# Altium project MainBoard.PrjPCB (part 1 of 2)
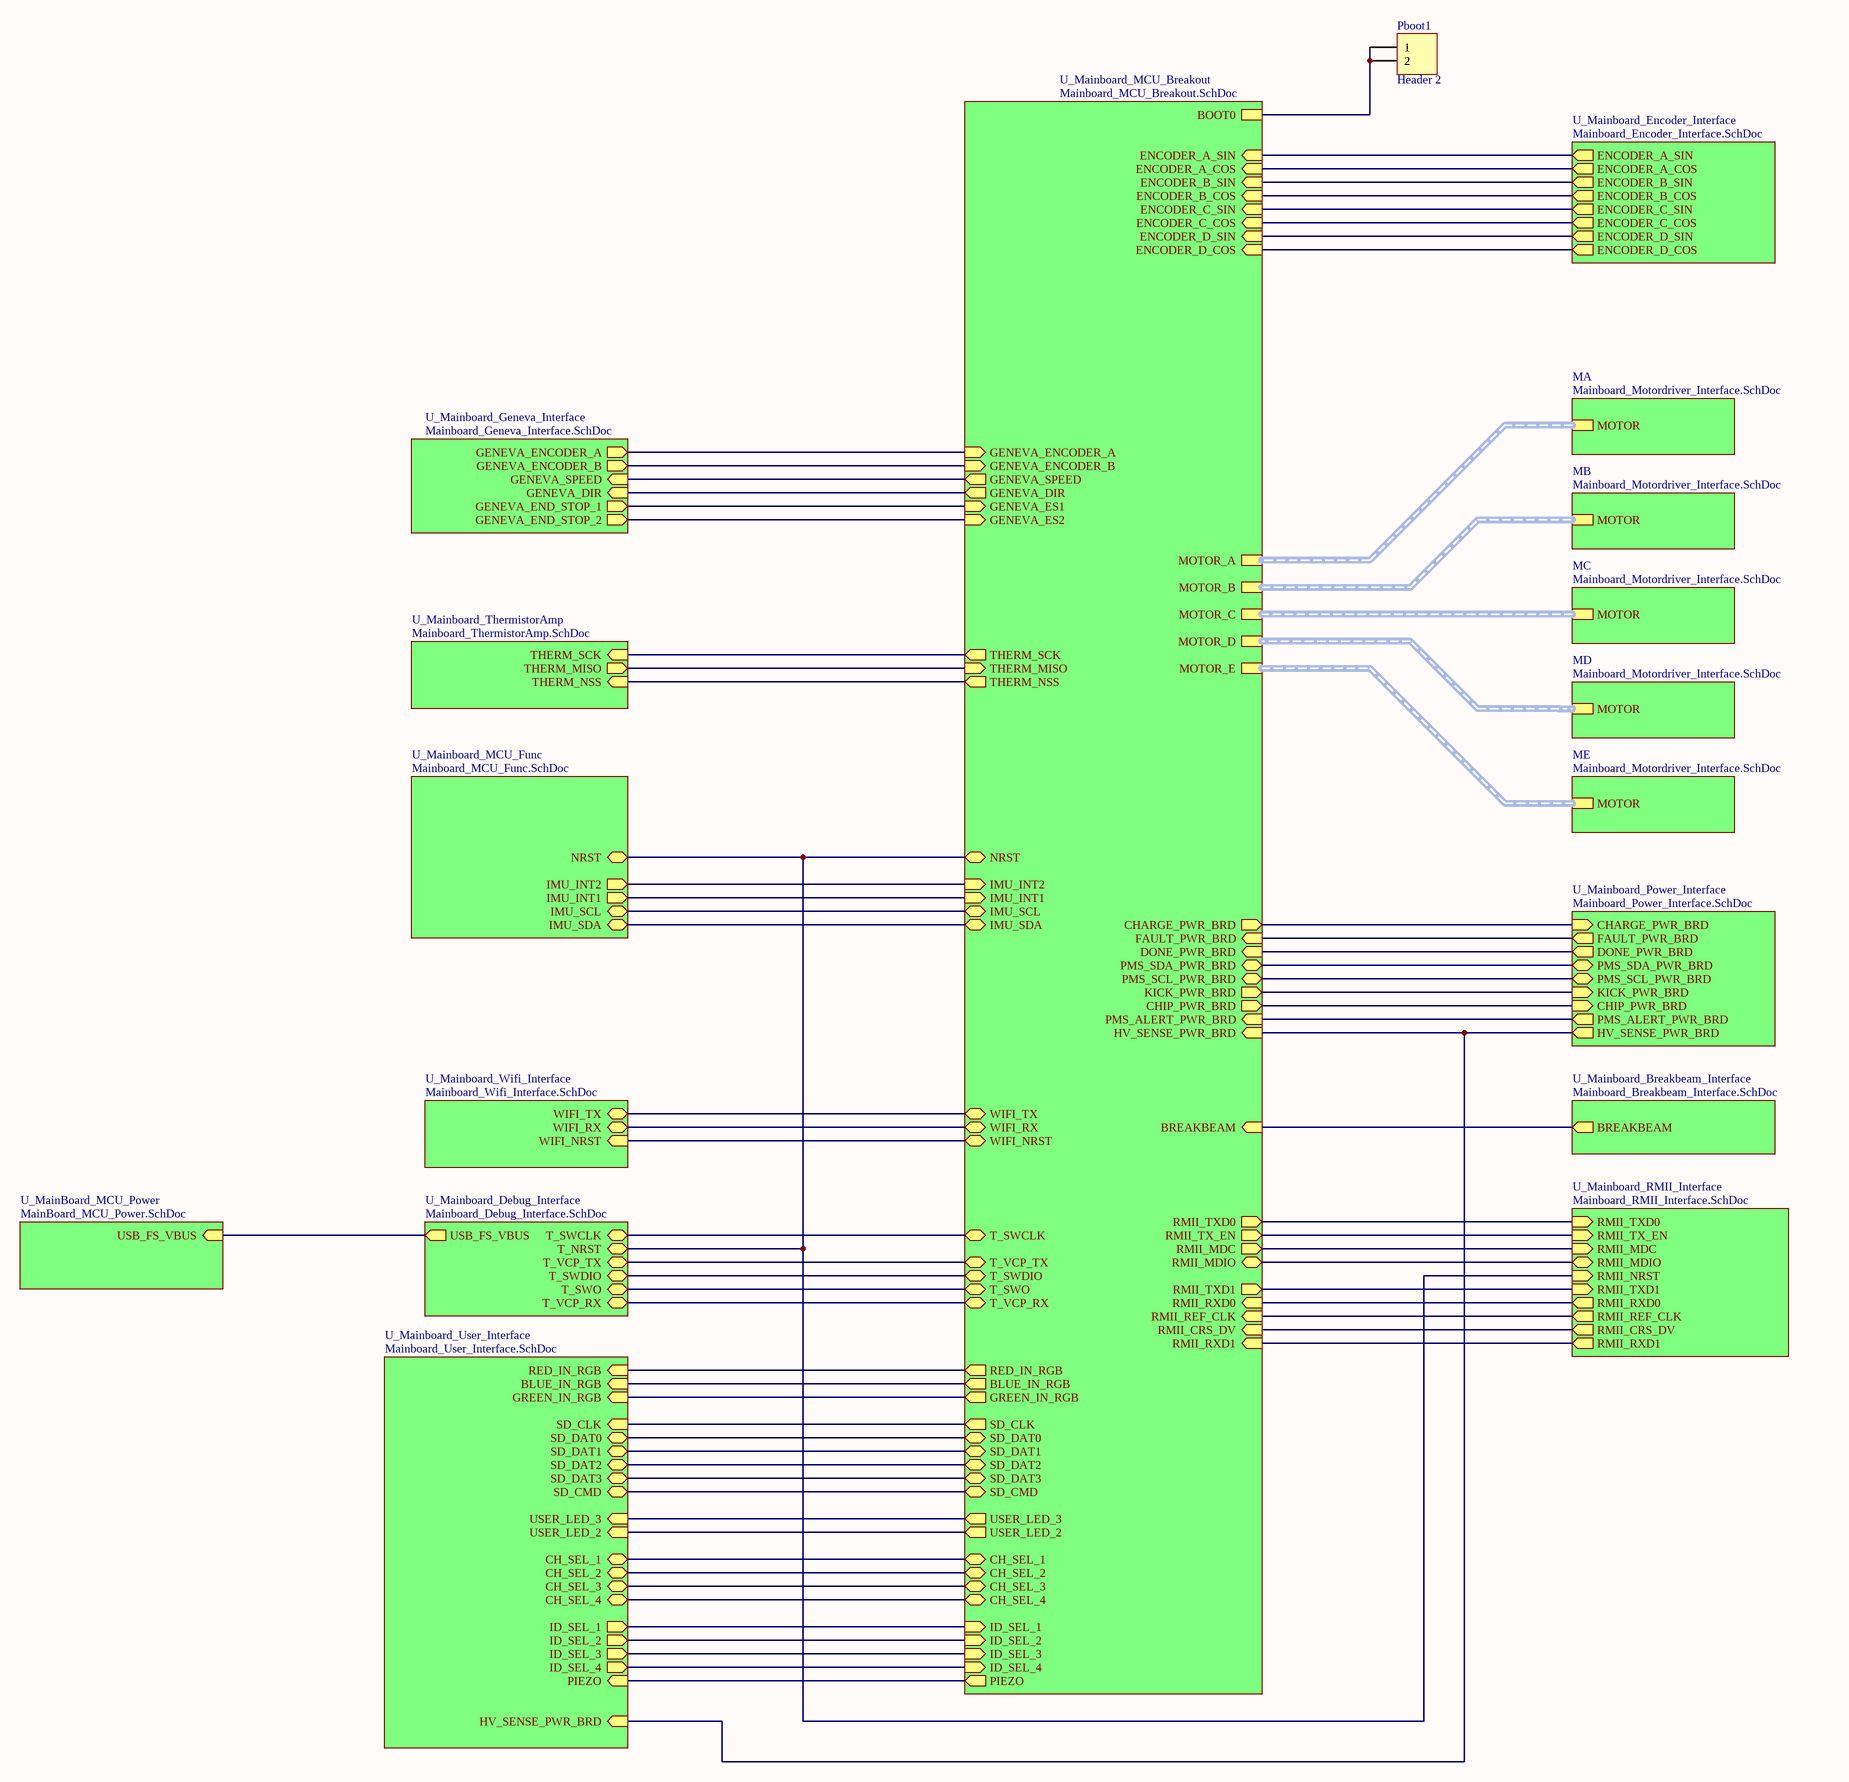
[diagram p0: MainBoard_Top.SchDoc]
14 sheets, 307 parts. Net scope: hierarchical (ports join the sheet entries above them; power ports are global).
Board file: MainBoard_Layout_V2.1.PcbDoc
Sheets:
  MainBoard_Top.SchDoc
    U_Mainboard_Encoder_Interface = Mainboard_Encoder_Interface.SchDoc
    U_Mainboard_Power_Interface = Mainboard_Power_Interface.SchDoc
    U_Mainboard_RMII_Interface = Mainboard_RMII_Interface.SchDoc
    U_Mainboard_Wifi_Interface = Mainboard_Wifi_Interface.SchDoc
    U_Mainboard_Breakbeam_Interface = Mainboard_Breakbeam_Interface.SchDoc
    U_MainBoard_MCU_Power = MainBoard_MCU_Power.SchDoc
    U_Mainboard_Debug_Interface = Mainboard_Debug_Interface.SchDoc
    U_Mainboard_MCU_Breakout = Mainboard_MCU_Breakout.SchDoc
    U_Mainboard_MCU_Func = Mainboard_MCU_Func.SchDoc
    U_Mainboard_ThermistorAmp = Mainboard_ThermistorAmp.SchDoc
    U_Mainboard_User_Interface = Mainboard_User_Interface.SchDoc
    U_Mainboard_Geneva_Interface = Mainboard_Geneva_Interface.SchDoc
    ME = Mainboard_Motordriver_Interface.SchDoc
    MD = Mainboard_Motordriver_Interface.SchDoc
    MC = Mainboard_Motordriver_Interface.SchDoc
    MB = Mainboard_Motordriver_Interface.SchDoc
    MA = Mainboard_Motordriver_Interface.SchDoc

## Sheet MainBoard_Top.SchDoc
size C

### Parts
Pboot1  Header 2  [HDR1X2]

### Sub-sheets
MA = Mainboard_Motordriver_Interface.SchDoc: MOTOR (harness MOTOR)
MB = Mainboard_Motordriver_Interface.SchDoc: MOTOR (harness MOTOR)
MC = Mainboard_Motordriver_Interface.SchDoc: MOTOR (harness MOTOR)
MD = Mainboard_Motordriver_Interface.SchDoc: MOTOR (harness MOTOR)
ME = Mainboard_Motordriver_Interface.SchDoc: MOTOR (harness MOTOR)
U_Mainboard_Breakbeam_Interface = Mainboard_Breakbeam_Interface.SchDoc: BREAKBEAM (out)
U_Mainboard_Debug_Interface = Mainboard_Debug_Interface.SchDoc: USB_FS_VBUS (out), T_SWCLK (bidir), T_NRST (bidir), T_VCP_TX (bidir), T_SWDIO (bidir), T_SWO (bidir), T_VCP_RX (bidir)
U_Mainboard_Encoder_Interface = Mainboard_Encoder_Interface.SchDoc: ENCODER_A_SIN (out), ENCODER_B_COS (out), ENCODER_C_COS (out), ENCODER_A_COS (out), ENCODER_D_SIN (out), ENCODER_D_COS (out), ENCODER_B_SIN (out), ENCODER_C_SIN (out)
U_Mainboard_Geneva_Interface = Mainboard_Geneva_Interface.SchDoc: GENEVA_SPEED (in), GENEVA_ENCODER_A (out), GENEVA_ENCODER_B (out), GENEVA_DIR (in), GENEVA_END_STOP_1 (out), GENEVA_END_STOP_2 (out)
U_Mainboard_MCU_Breakout = Mainboard_MCU_Breakout.SchDoc: BOOT0, T_SWCLK (bidir), T_VCP_TX (bidir), T_SWDIO (bidir), T_SWO (bidir), T_VCP_RX (bidir), RED_IN_RGB (out), BLUE_IN_RGB (out), GREEN_IN_RGB (out), SD_CLK (out), SD_DAT0 (bidir), SD_DAT1 (bidir), SD_DAT2 (bidir), SD_DAT3 (bidir), SD_CMD (bidir), CH_SEL_1 (bidir), CH_SEL_2 (bidir), CH_SEL_3 (bidir), CH_SEL_4 (bidir), ENCODER_A_SIN (in), ENCODER_A_COS (in), ENCODER_B_SIN (in), ENCODER_B_COS (in), ENCODER_C_SIN (in), ENCODER_C_COS (in), ENCODER_D_SIN (in), ENCODER_D_COS (in), USER_LED_3 (out), USER_LED_2 (out), NRST (bidir), IMU_INT2 (in), IMU_INT1 (in), BREAKBEAM (in), RMII_TXD0 (out), RMII_TX_EN (out), RMII_MDC (out), RMII_MDIO (bidir), RMII_TXD1 (out), RMII_RXD0 (in), RMII_REF_CLK (in), RMII_CRS_DV (in), RMII_RXD1 (in), HV_SENSE_PWR_BRD (in), PMS_ALERT_PWR_BRD (in), CHIP_PWR_BRD (out), KICK_PWR_BRD (out), PMS_SCL_PWR_BRD (bidir), PMS_SDA_PWR_BRD (bidir), DONE_PWR_BRD (in), FAULT_PWR_BRD (in), CHARGE_PWR_BRD (out), IMU_SDA (bidir), IMU_SCL (bidir), THERM_NSS (out), THERM_MISO (in), THERM_SCK (out), WIFI_RX (bidir), WIFI_TX (bidir), ID_SEL_3 (in), ID_SEL_1 (in), ID_SEL_2 (in), ID_SEL_4 (in), GENEVA_SPEED (out), PIEZO (out), GENEVA_DIR (out), WIFI_NRST (bidir), MOTOR_E (harness MOTOR_E), MOTOR_D (harness MOTOR_D), MOTOR_A (harness MOTOR_A), MOTOR_B (harness MOTOR_B), MOTOR_C (harness MOTOR_C), GENEVA_ENCODER_A (in), GENEVA_ES1 (in), GENEVA_ES2 (in), GENEVA_ENCODER_B (in)
U_Mainboard_MCU_Func = Mainboard_MCU_Func.SchDoc: NRST (bidir), IMU_SCL (bidir), IMU_SDA (bidir), IMU_INT1 (out), IMU_INT2 (out)
U_MainBoard_MCU_Power = MainBoard_MCU_Power.SchDoc: USB_FS_VBUS (in)
U_Mainboard_Power_Interface = Mainboard_Power_Interface.SchDoc: CHARGE_PWR_BRD (in), FAULT_PWR_BRD (out), DONE_PWR_BRD (out), PMS_SDA_PWR_BRD (bidir), PMS_SCL_PWR_BRD (bidir), KICK_PWR_BRD (in), CHIP_PWR_BRD (in), PMS_ALERT_PWR_BRD (out), HV_SENSE_PWR_BRD (out)
U_Mainboard_RMII_Interface = Mainboard_RMII_Interface.SchDoc: RMII_TXD0 (in), RMII_TX_EN (in), RMII_RXD0 (out), RMII_REF_CLK (out), RMII_CRS_DV (out), RMII_MDC (in), RMII_MDIO (bidir), RMII_NRST (in), RMII_TXD1 (in), RMII_RXD1 (out)
U_Mainboard_ThermistorAmp = Mainboard_ThermistorAmp.SchDoc: THERM_NSS (in), THERM_MISO (out), THERM_SCK (in)
U_Mainboard_User_Interface = Mainboard_User_Interface.SchDoc: RED_IN_RGB (in), BLUE_IN_RGB (in), GREEN_IN_RGB (in), SD_CLK (in), SD_DAT0 (bidir), SD_DAT1 (bidir), SD_DAT2 (bidir), SD_DAT3 (bidir), SD_CMD (bidir), USER_LED_3 (in), USER_LED_2 (in), CH_SEL_1 (bidir), CH_SEL_2 (bidir), CH_SEL_3 (bidir), CH_SEL_4 (bidir), ID_SEL_1 (out), ID_SEL_2 (out), ID_SEL_3 (out), ID_SEL_4 (out), HV_SENSE_PWR_BRD (in), PIEZO (in)
U_Mainboard_Wifi_Interface = Mainboard_Wifi_Interface.SchDoc: WIFI_NRST (in), WIFI_TX (bidir), WIFI_RX (bidir)

### Nets
BREAKBEAM: sheet U_Mainboard_Breakbeam_Interface/BREAKBEAM, sheet U_Mainboard_MCU_Breakout/BREAKBEAM
CHARGE_PWR_BRD: sheet U_Mainboard_Power_Interface/CHARGE_PWR_BRD, sheet U_Mainboard_MCU_Breakout/CHARGE_PWR_BRD
CHIP_PWR_BRD: sheet U_Mainboard_Power_Interface/CHIP_PWR_BRD, sheet U_Mainboard_MCU_Breakout/CHIP_PWR_BRD
DONE_PWR_BRD: sheet U_Mainboard_Power_Interface/DONE_PWR_BRD, sheet U_Mainboard_MCU_Breakout/DONE_PWR_BRD
EA_COS: sheet U_Mainboard_Encoder_Interface/ENCODER_A_COS, sheet U_Mainboard_MCU_Breakout/ENCODER_A_COS
EA_SIN: sheet U_Mainboard_Encoder_Interface/ENCODER_A_SIN, sheet U_Mainboard_MCU_Breakout/ENCODER_A_SIN
EB_COS: sheet U_Mainboard_Encoder_Interface/ENCODER_B_COS, sheet U_Mainboard_MCU_Breakout/ENCODER_B_COS
EB_SIN: sheet U_Mainboard_Encoder_Interface/ENCODER_B_SIN, sheet U_Mainboard_MCU_Breakout/ENCODER_B_SIN
EC_COS: sheet U_Mainboard_Encoder_Interface/ENCODER_C_COS, sheet U_Mainboard_MCU_Breakout/ENCODER_C_COS
EC_SIN: sheet U_Mainboard_Encoder_Interface/ENCODER_C_SIN, sheet U_Mainboard_MCU_Breakout/ENCODER_C_SIN
ED_COS: sheet U_Mainboard_Encoder_Interface/ENCODER_D_COS, sheet U_Mainboard_MCU_Breakout/ENCODER_D_COS
ED_SIN: sheet U_Mainboard_Encoder_Interface/ENCODER_D_SIN, sheet U_Mainboard_MCU_Breakout/ENCODER_D_SIN
FAULT_PWR_BRD: sheet U_Mainboard_Power_Interface/FAULT_PWR_BRD, sheet U_Mainboard_MCU_Breakout/FAULT_PWR_BRD
GEN_DIR: sheet U_Mainboard_MCU_Breakout/GENEVA_DIR, sheet U_Mainboard_Geneva_Interface/GENEVA_DIR
GEN_ES1: sheet U_Mainboard_MCU_Breakout/GENEVA_ES1, sheet U_Mainboard_Geneva_Interface/GENEVA_END_STOP_1
GEN_ES2: sheet U_Mainboard_MCU_Breakout/GENEVA_ES2, sheet U_Mainboard_Geneva_Interface/GENEVA_END_STOP_2
GEN_SPD: sheet U_Mainboard_MCU_Breakout/GENEVA_SPEED, sheet U_Mainboard_Geneva_Interface/GENEVA_SPEED
GENENC_A: sheet U_Mainboard_MCU_Breakout/GENEVA_ENCODER_A, sheet U_Mainboard_Geneva_Interface/GENEVA_ENCODER_A
GENENC_B: sheet U_Mainboard_MCU_Breakout/GENEVA_ENCODER_B, sheet U_Mainboard_Geneva_Interface/GENEVA_ENCODER_B
KICK_PWR_BRD: sheet U_Mainboard_Power_Interface/KICK_PWR_BRD, sheet U_Mainboard_MCU_Breakout/KICK_PWR_BRD
NRST: sheet U_Mainboard_RMII_Interface/RMII_NRST, sheet U_Mainboard_Debug_Interface/T_NRST, sheet U_Mainboard_MCU_Breakout/NRST, sheet U_Mainboard_MCU_Func/NRST
PMS_ALERT_PWR_BRD: sheet U_Mainboard_Power_Interface/PMS_ALERT_PWR_BRD, sheet U_Mainboard_MCU_Breakout/PMS_ALERT_PWR_BRD
PMS_SCL_PWR_BRD: sheet U_Mainboard_Power_Interface/PMS_SCL_PWR_BRD, sheet U_Mainboard_MCU_Breakout/PMS_SCL_PWR_BRD
PMS_SDA_PWR_BRD: sheet U_Mainboard_Power_Interface/PMS_SDA_PWR_BRD, sheet U_Mainboard_MCU_Breakout/PMS_SDA_PWR_BRD
RMII_CRS_DV: sheet U_Mainboard_RMII_Interface/RMII_CRS_DV, sheet U_Mainboard_MCU_Breakout/RMII_CRS_DV
RMII_MDC: sheet U_Mainboard_RMII_Interface/RMII_MDC, sheet U_Mainboard_MCU_Breakout/RMII_MDC
RMII_MDIO: sheet U_Mainboard_RMII_Interface/RMII_MDIO, sheet U_Mainboard_MCU_Breakout/RMII_MDIO
RMII_REF_CLK: sheet U_Mainboard_RMII_Interface/RMII_REF_CLK, sheet U_Mainboard_MCU_Breakout/RMII_REF_CLK
RMII_RXD0: sheet U_Mainboard_RMII_Interface/RMII_RXD0, sheet U_Mainboard_MCU_Breakout/RMII_RXD0
RMII_RXD1: sheet U_Mainboard_RMII_Interface/RMII_RXD1, sheet U_Mainboard_MCU_Breakout/RMII_RXD1
RMII_TX_EN: sheet U_Mainboard_RMII_Interface/RMII_TX_EN, sheet U_Mainboard_MCU_Breakout/RMII_TX_EN
RMII_TXD0: sheet U_Mainboard_RMII_Interface/RMII_TXD0, sheet U_Mainboard_MCU_Breakout/RMII_TXD0
RMII_TXD1: sheet U_Mainboard_RMII_Interface/RMII_TXD1, sheet U_Mainboard_MCU_Breakout/RMII_TXD1
NetD3_1: sheet U_Mainboard_MCU_Breakout/PIEZO, sheet U_Mainboard_User_Interface/PIEZO
NetF1_1: sheet U_MainBoard_MCU_Power/USB_FS_VBUS, sheet U_Mainboard_Debug_Interface/USB_FS_VBUS
NetHV_FB1_1: sheet U_Mainboard_Power_Interface/HV_SENSE_PWR_BRD, sheet U_Mainboard_MCU_Breakout/HV_SENSE_PWR_BRD, sheet U_Mainboard_User_Interface/HV_SENSE_PWR_BRD
NetJ9_2: sheet U_Mainboard_Wifi_Interface/WIFI_RX, sheet U_Mainboard_MCU_Breakout/WIFI_RX
NetJ9_3: sheet U_Mainboard_Wifi_Interface/WIFI_TX, sheet U_Mainboard_MCU_Breakout/WIFI_TX
NetJ9_4: sheet U_Mainboard_Wifi_Interface/WIFI_NRST, sheet U_Mainboard_MCU_Breakout/WIFI_NRST
NetJ12_1: sheet U_Mainboard_MCU_Breakout/SD_DAT2, sheet U_Mainboard_User_Interface/SD_DAT2
NetJ12_2: sheet U_Mainboard_MCU_Breakout/SD_DAT3, sheet U_Mainboard_User_Interface/SD_DAT3
NetJ12_3: sheet U_Mainboard_MCU_Breakout/SD_CMD, sheet U_Mainboard_User_Interface/SD_CMD
NetJ12_5: sheet U_Mainboard_MCU_Breakout/SD_CLK, sheet U_Mainboard_User_Interface/SD_CLK
NetJ12_7: sheet U_Mainboard_MCU_Breakout/SD_DAT0, sheet U_Mainboard_User_Interface/SD_DAT0
NetJ12_8: sheet U_Mainboard_MCU_Breakout/SD_DAT1, sheet U_Mainboard_User_Interface/SD_DAT1
NetPboot1_1: Pboot1.1 Pboot1.2 ; sheet U_Mainboard_MCU_Breakout/BOOT0
NetR91_2: sheet U_Mainboard_MCU_Breakout/USER_LED_2, sheet U_Mainboard_User_Interface/USER_LED_2
NetR94_1: sheet U_Mainboard_MCU_Breakout/RED_IN_RGB, sheet U_Mainboard_User_Interface/RED_IN_RGB
NetR95_1: sheet U_Mainboard_MCU_Breakout/BLUE_IN_RGB, sheet U_Mainboard_User_Interface/BLUE_IN_RGB
NetR97_1: sheet U_Mainboard_MCU_Breakout/GREEN_IN_RGB, sheet U_Mainboard_User_Interface/GREEN_IN_RGB
NetR99_2: sheet U_Mainboard_MCU_Breakout/USER_LED_3, sheet U_Mainboard_User_Interface/USER_LED_3
NetR109_1: sheet U_Mainboard_MCU_Breakout/THERM_SCK, sheet U_Mainboard_ThermistorAmp/THERM_SCK
NetR110_1: sheet U_Mainboard_MCU_Breakout/THERM_MISO, sheet U_Mainboard_ThermistorAmp/THERM_MISO
NetR111_1: sheet U_Mainboard_MCU_Breakout/THERM_NSS, sheet U_Mainboard_ThermistorAmp/THERM_NSS
NetR115_2: sheet U_Mainboard_MCU_Breakout/CH_SEL_1, sheet U_Mainboard_User_Interface/CH_SEL_1
NetR116_2: sheet U_Mainboard_MCU_Breakout/CH_SEL_2, sheet U_Mainboard_User_Interface/CH_SEL_2
NetR117_2: sheet U_Mainboard_MCU_Breakout/CH_SEL_3, sheet U_Mainboard_User_Interface/CH_SEL_3
NetR118_2: sheet U_Mainboard_MCU_Breakout/CH_SEL_4, sheet U_Mainboard_User_Interface/CH_SEL_4
NetR119_2: sheet U_Mainboard_MCU_Breakout/ID_SEL_1, sheet U_Mainboard_User_Interface/ID_SEL_1
NetR120_2: sheet U_Mainboard_MCU_Breakout/ID_SEL_2, sheet U_Mainboard_User_Interface/ID_SEL_2
NetR121_2: sheet U_Mainboard_MCU_Breakout/ID_SEL_3, sheet U_Mainboard_User_Interface/ID_SEL_3
NetR122_2: sheet U_Mainboard_MCU_Breakout/ID_SEL_4, sheet U_Mainboard_User_Interface/ID_SEL_4
NetU9_4: sheet U_Mainboard_MCU_Breakout/IMU_INT1, sheet U_Mainboard_MCU_Func/IMU_INT1
NetU9_9: sheet U_Mainboard_MCU_Breakout/IMU_INT2, sheet U_Mainboard_MCU_Func/IMU_INT2
NetU9_13: sheet U_Mainboard_MCU_Breakout/IMU_SCL, sheet U_Mainboard_MCU_Func/IMU_SCL
NetU9_14: sheet U_Mainboard_MCU_Breakout/IMU_SDA, sheet U_Mainboard_MCU_Func/IMU_SDA
NetU10_4: sheet U_Mainboard_Debug_Interface/T_SWDIO, sheet U_Mainboard_MCU_Breakout/T_SWDIO
NetU10_6: sheet U_Mainboard_Debug_Interface/T_SWO, sheet U_Mainboard_MCU_Breakout/T_SWO
NetU10_12: sheet U_Mainboard_Debug_Interface/T_VCP_TX, sheet U_Mainboard_MCU_Breakout/T_VCP_TX
NetU10_13: sheet U_Mainboard_Debug_Interface/T_SWCLK, sheet U_Mainboard_MCU_Breakout/T_SWCLK
NetU10_15: sheet U_Mainboard_Debug_Interface/T_VCP_RX, sheet U_Mainboard_MCU_Breakout/T_VCP_RX

### Buses and harness runs
harness sheet MA/MOTOR = sheet U_Mainboard_MCU_Breakout/MOTOR_A
harness sheet MB/MOTOR = sheet U_Mainboard_MCU_Breakout/MOTOR_B
harness sheet MC/MOTOR = sheet U_Mainboard_MCU_Breakout/MOTOR_C
harness sheet MD/MOTOR = sheet U_Mainboard_MCU_Breakout/MOTOR_D
harness sheet ME/MOTOR = sheet U_Mainboard_MCU_Breakout/MOTOR_E

### Library data of the parts
Pboot1 = Header 2: Header, 2-Pin; LatestRevisionDate: 17-Jul-2002; LatestRevisionNote: Re-released for DXP Platform.; Publisher: Altium Limited

## Sheet Mainboard_Encoder_Interface.SchDoc
size 381 x 254 mm
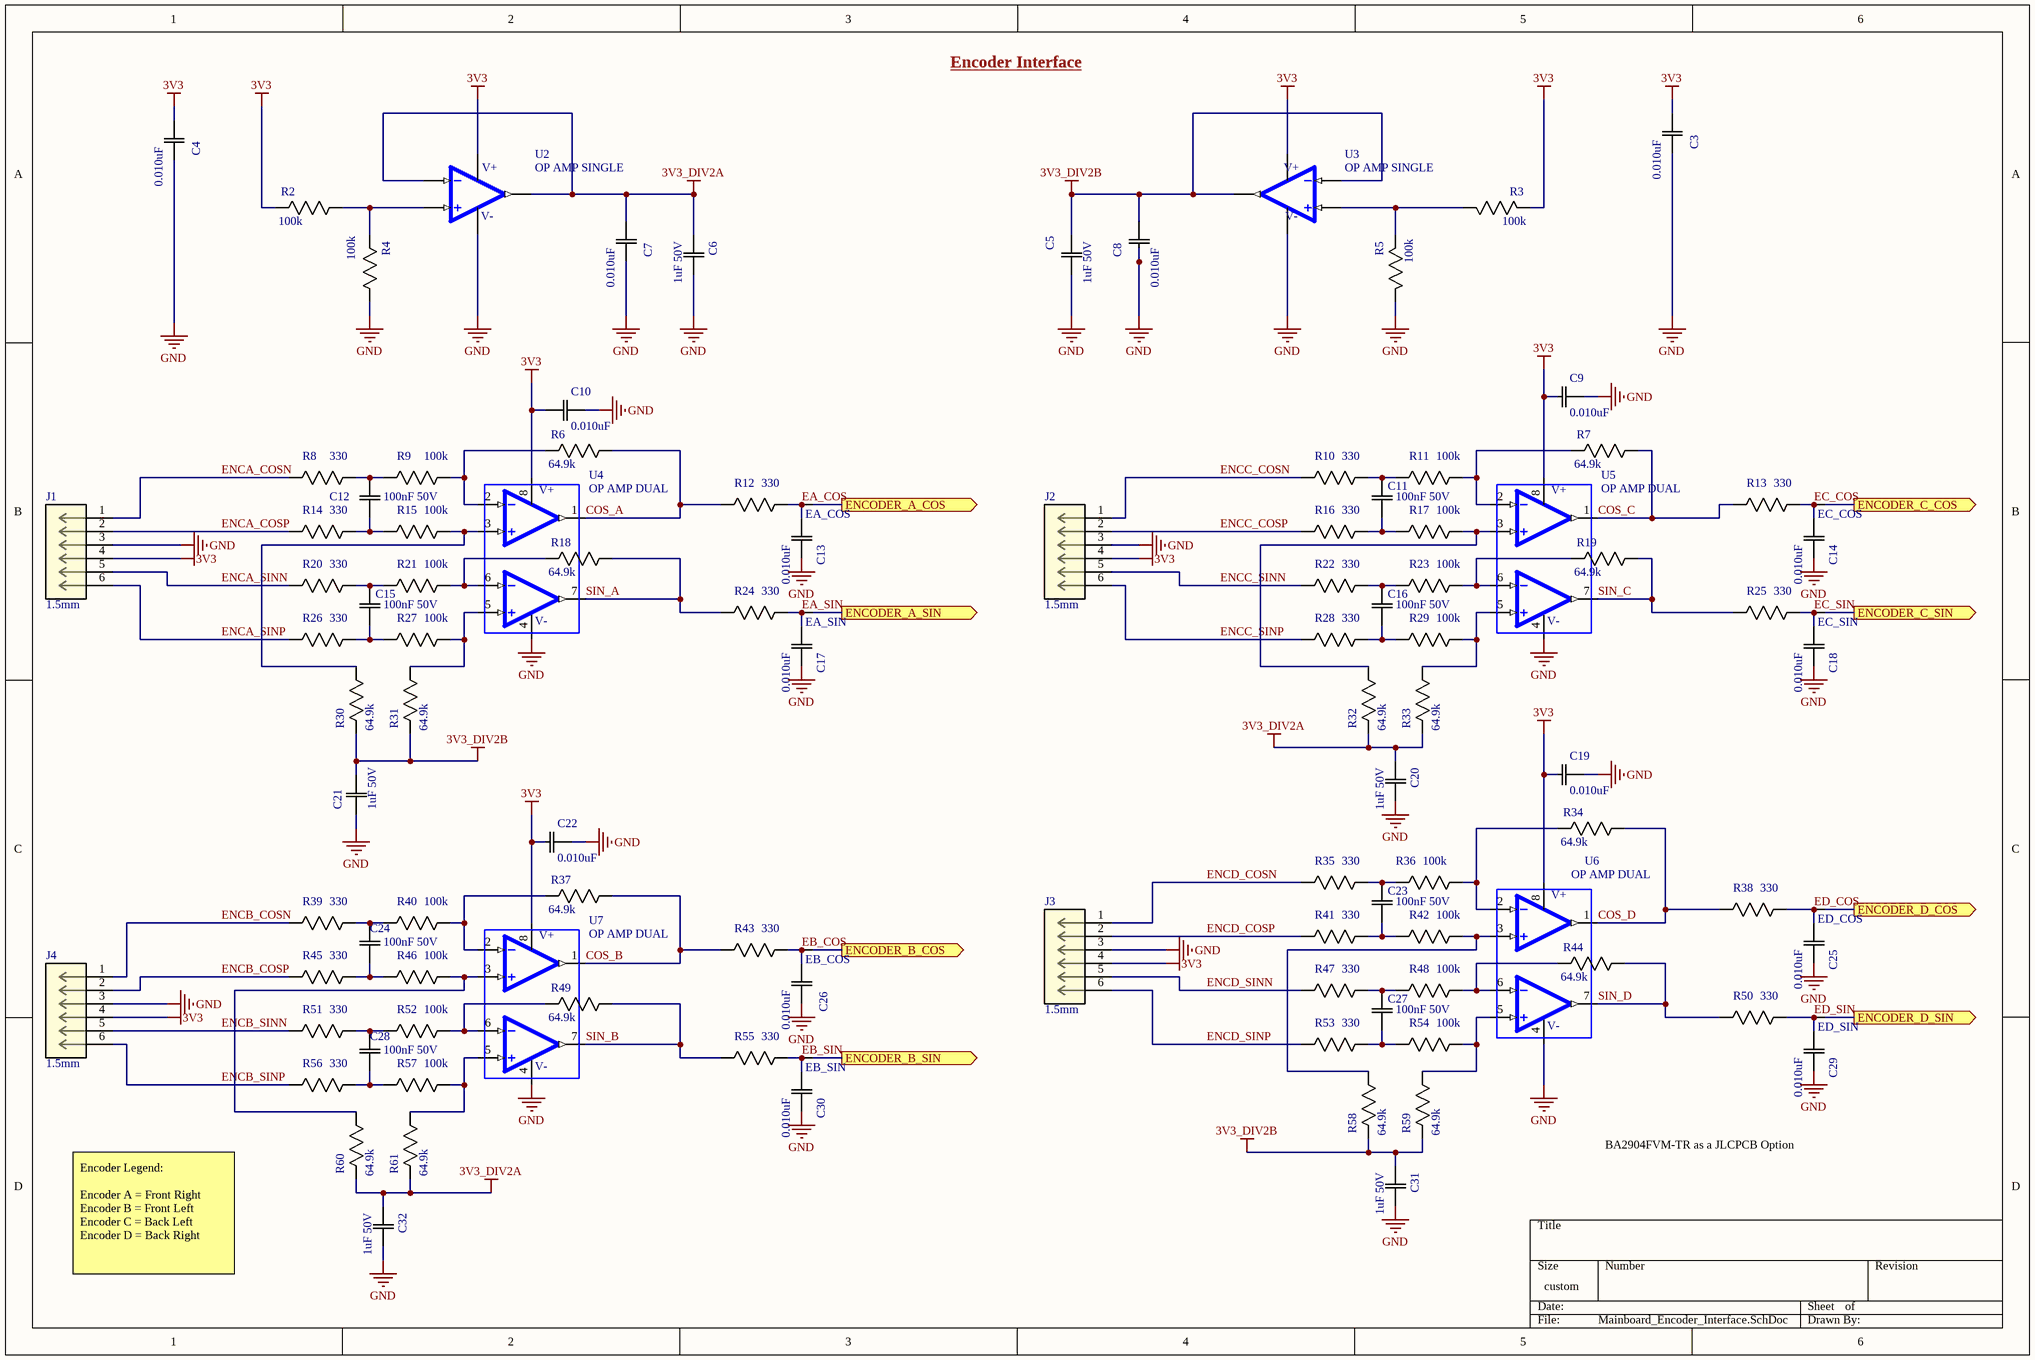
[diagram p1: Mainboard_Encoder_Interface.SchDoc]

### Parts
C3  0.010uF  [0603]
C4  0.010uF  [0603]
C5  1uF 50V  [0603]
C6  1uF 50V  [0603]
C7  0.010uF  [0603]
C8  0.010uF  [0603]
C9  0.010uF  [0603]
C10  0.010uF  [0603]
C11  100nF 50V  [0603]
C12  100nF 50V  [0603]
C13  0.010uF  [0603]
C14  0.010uF  [0603]
C15  100nF 50V  [0603]
C16  100nF 50V  [0603]
C17  0.010uF  [0603]
C18  0.010uF  [0603]
C19  0.010uF  [0603]
C20  1uF 50V  [0603]
C21  1uF 50V  [0603]
C22  0.010uF  [0603]
C23  100nF 50V  [0603]
C24  100nF 50V  [0603]
C25  0.010uF  [0603]
C26  0.010uF  [0603]
C27  100nF 50V  [0603]
C28  100nF 50V  [0603]
C29  0.010uF  [0603]
C30  0.010uF  [0603]
C31  1uF 50V  [0603]
C32  1uF 50V  [0603]
EA_COS  Test Point (Via)  [TP]  (value not drawn)
EA_SIN  Test Point (Via)  [TP]  (value not drawn)
EB_COS  Test Point (Via)  [TP]  (value not drawn)
EB_SIN  Test Point (Via)  [TP]  (value not drawn)
EC_COS  Test Point (Via)  [TP]  (value not drawn)
EC_SIN  Test Point (Via)  [TP]  (value not drawn)
ED_COS  Test Point (Via)  [TP]  (value not drawn)
ED_SIN  Test Point (Via)  [TP]  (value not drawn)
J1  1.5mm  [6POS JST Vertical]
J2  1.5mm  [6POS JST Vertical]
J3  1.5mm  [6POS JST Vertical]
J4  1.5mm  [6POS JST Vertical]
R2  100k  [0603]
R3  100k  [0603]
R4  100k  [0603]
R5  100k  [0603]
R6  64.9k  [0603]
R7  64.9k  [0603]
R8  330  [0603]
R9  100k  [0603]
R10  330  [0603]
R11  100k  [0603]
R12  330  [0603]
R13  330  [0603]
R14  330  [0603]
R15  100k  [0603]
R16  330  [0603]
R17  100k  [0603]
R18  64.9k  [0603]
R19  64.9k  [0603]
R20  330  [0603]
R21  100k  [0603]
R22  330  [0603]
R23  100k  [0603]
R24  330  [0603]
R25  330  [0603]
R26  330  [0603]
R27  100k  [0603]
R28  330  [0603]
R29  100k  [0603]
R30  64.9k  [0603]
R31  64.9k  [0603]
R32  64.9k  [0603]
R33  64.9k  [0603]
R34  64.9k  [0603]
R35  330  [0603]
R36  100k  [0603]
R37  64.9k  [0603]
R38  330  [0603]
R39  330  [0603]
R40  100k  [0603]
R41  330  [0603]
R42  100k  [0603]
R43  330  [0603]
R44  64.9k  [0603]
R45  330  [0603]
R46  100k  [0603]
R47  330  [0603]
R48  100k  [0603]
R49  64.9k  [0603]
R50  330  [0603]
R51  330  [0603]
R52  100k  [0603]
R53  330  [0603]
R54  100k  [0603]
R55  330  [0603]
R56  330  [0603]
R57  100k  [0603]
R58  64.9k  [0603]
R59  64.9k  [0603]
R60  64.9k  [0603]
R61  64.9k  [0603]
U2  OP AMP SINGLE  [SOT95P280X145-5N]
U3  OP AMP SINGLE  [SOT95P280X145-5N]
U4  OP AMP DUAL  [8-MSOP]
U5  OP AMP DUAL  [8-MSOP]
U6  OP AMP DUAL  [8-MSOP]
U7  OP AMP DUAL  [8-MSOP]

### Ports
ENCODER_A_COS (out), ENCODER_A_SIN (out), ENCODER_B_COS (out), ENCODER_B_SIN (out), ENCODER_C_COS (out), ENCODER_C_SIN (out), ENCODER_D_COS (out), ENCODER_D_SIN (out)

### Nets
3V3: C3.1(C1) C4.1(C1) C9.1(C1) C10.1(C1) C19.1(C1) C22.1(C1) J1.4 J2.4 J3.4 J4.4 R2.2(R2) R3.2(R2) U2.5(V+) U3.5(V+) U4.8(V+) U5.8(V+) U6.8(V+) U7.8(V+)
3V3_DIV2A: C6.1(C1) C7.1(C1) C20.1(C1) C32.1(C1) R32.2(R2) R33.2(R2) R60.2(R2) R61.2(R2) U2.1(OUT) U2.4(IN-)
3V3_DIV2B: C5.1(C1) C8.1(C1) C21.2(C2) C31.1(C1) R30.2(R2) R31.2(R2) R58.2(R2) R59.2(R2) U3.1(OUT) U3.4(IN-)
GND: C3.2(C2) C4.2(C2) C5.2(C2) C6.2(C2) C7.2(C2) C8.2(C2) C9.2(C2) C10.2(C2) C13.2(C2) C14.2(C2) C17.2(C2) C18.2(C2) C19.2(C2) C20.2(C2) C21.1(C1) C22.2(C2) C25.2(C2) C26.2(C2) C29.2(C2) C30.2(C2) C31.2(C2) C32.2(C2) J1.3 J2.3 J3.3 J4.3 R4.1(R1) R5.1(R1) U2.2(V-) U3.2(V-) U4.4(V-) U5.4(V-) U6.4(V-) U7.4(V-)
COS_A: R6.1(R1) R12.2(R2) U4.1(OUTA)
COS_B: R37.1(R1) R43.2(R2) U7.1(OUTA)
COS_C: R7.1(R1) R13.2(R2) U5.1(OUTA)
COS_D: R34.1(R1) R38.2(R2) U6.1(OUTA)
EA_COS: C13.1(C1) EA_COS.1 R12.1(R1) ; port ENCODER_A_COS
EA_SIN: C17.1(C1) EA_SIN.1 R24.1(R1) ; port ENCODER_A_SIN
EB_COS: C26.1(C1) EB_COS.1 R43.1(R1) ; port ENCODER_B_COS
EB_SIN: C30.1(C1) EB_SIN.1 R55.1(R1) ; port ENCODER_B_SIN
EC_COS: C14.1(C1) EC_COS.1 R13.1(R1) ; port ENCODER_C_COS
EC_SIN: C18.1(C1) EC_SIN.1 R25.1(R1) ; port ENCODER_C_SIN
ED_COS: C25.1(C1) ED_COS.1 R38.1(R1) ; port ENCODER_D_COS
ED_SIN: C29.1(C1) ED_SIN.1 R50.1(R1) ; port ENCODER_D_SIN
ENCA_COSN: J1.1 R8.2(R2)
ENCA_COSP: J1.2 R14.2(R2)
ENCA_SINN: J1.5 R20.2(R2)
ENCA_SINP: J1.6 R26.2(R2)
ENCB_COSN: J4.1 R39.2(R2)
ENCB_COSP: J4.2 R45.2(R2)
ENCB_SINN: J4.5 R51.2(R2)
ENCB_SINP: J4.6 R56.2(R2)
ENCC_COSN: J2.1 R10.2(R2)
ENCC_COSP: J2.2 R16.2(R2)
ENCC_SINN: J2.5 R22.2(R2)
ENCC_SINP: J2.6 R28.2(R2)
ENCD_COSN: J3.1 R35.2(R2)
ENCD_COSP: J3.2 R41.2(R2)
ENCD_SINN: J3.5 R47.2(R2)
ENCD_SINP: J3.6 R53.2(R2)
SIN_A: R18.1(R1) R24.2(R2) U4.7(OUTB)
SIN_B: R49.1(R1) R55.2(R2) U7.7(OUTB)
SIN_C: R19.1(R1) R25.2(R2) U5.7(OUTB)
SIN_D: R44.1(R1) R50.2(R2) U6.7(OUTB)
NetC11_1: C11.1(C1) R10.1(R1) R11.2(R2)
NetC11_2: C11.2(C2) R16.1(R1) R17.2(R2)
NetC12_1: C12.1(C1) R8.1(R1) R9.2(R2)
NetC12_2: C12.2(C2) R14.1(R1) R15.2(R2)
NetC15_1: C15.1(C1) R20.1(R1) R21.2(R2)
NetC15_2: C15.2(C2) R26.1(R1) R27.2(R2)
NetC16_1: C16.1(C1) R22.1(R1) R23.2(R2)
NetC16_2: C16.2(C2) R28.1(R1) R29.2(R2)
NetC23_1: C23.1(C1) R35.1(R1) R36.2(R2)
NetC23_2: C23.2(C2) R41.1(R1) R42.2(R2)
NetC24_1: C24.1(C1) R39.1(R1) R40.2(R2)
NetC24_2: C24.2(C2) R45.1(R1) R46.2(R2)
NetC27_1: C27.1(C1) R47.1(R1) R48.2(R2)
NetC27_2: C27.2(C2) R53.1(R1) R54.2(R2)
NetC28_1: C28.1(C1) R51.1(R1) R52.2(R2)
NetC28_2: C28.2(C2) R56.1(R1) R57.2(R2)
NetR2_1: R2.1(R1) R4.2(R2) U2.3(IN+)
NetR3_1: R3.1(R1) R5.2(R2) U3.3(IN+)
NetR6_2: R6.2(R2) R9.1(R1) U4.2(INA-)
NetR7_2: R7.2(R2) R11.1(R1) U5.2(INA-)
NetR15_1: R15.1(R1) R30.1(R1) U4.3(INA+)
NetR17_1: R17.1(R1) R32.1(R1) U5.3(INA+)
NetR18_2: R18.2(R2) R21.1(R1) U4.6(INB-)
NetR19_2: R19.2(R2) R23.1(R1) U5.6(INB-)
NetR27_1: R27.1(R1) R31.1(R1) U4.5(INB+)
NetR29_1: R29.1(R1) R33.1(R1) U5.5(INB+)
NetR34_2: R34.2(R2) R36.1(R1) U6.2(INA-)
NetR37_2: R37.2(R2) R40.1(R1) U7.2(INA-)
NetR42_1: R42.1(R1) R58.1(R1) U6.3(INA+)
NetR44_2: R44.2(R2) R48.1(R1) U6.6(INB-)
NetR46_1: R46.1(R1) R60.1(R1) U7.3(INA+)
NetR49_2: R49.2(R2) R52.1(R1) U7.6(INB-)
NetR54_1: R54.1(R1) R59.1(R1) U6.5(INB+)
NetR57_1: R57.1(R1) R61.1(R1) U7.5(INB+)

### Notes on the sheet
- Encoder Interface
- BA2904FVM-TR as a JLCPCB Option
- Encoder Legend:
  Encoder A = Front Right
  Encoder B = Front Left
  Encoder C = Back Left
  Encoder D = Back Right

### Library data of the parts
C3 C4 C7-C10 C13 C14 C17-C19 C22 C25 C26 C29 C30 = CAP 0.010uF 50V: CAP CER 0.010UF 50V X7R 0603/0805; Tolerance: 10%; Package: 0603/0805; Value: 0.010uF; Rating: 50V; Temperature Coefficient: X7R; Operating Temperature: -55°C ~ 125°C
C5 C6 C20 C21 C31 C32 = CAP 1uF 50V: CAP CER 1UF 50V X7R 0805; Tolerance: 10%; Package: 0805; Value: 1uF; Rating: 50V; Temperature Coefficient: X7R; Operating Temperature: -55°C ~ 125°C
C11 C12 C15 C16 C23 C24 C27 C28 = CAP 100nF 50V: CAP CER 0.1UF 50V X7R 0805; Tolerance: 10%; Package: 0805; Value: 100nF; Rating: 50V
J1-J4 = CN 6POS JST RA: Conn Shrouded Header HDR 6 POS 1.5mm Solder RA Thru-Hole Box; Manufacturer: JST; Manufacturer Part Number: S6B-ZR(LF)(SN); Body Plating: Tin; Number of Positions: 6; Current Rating: 1A; Connector Type: Header,Male Pin; Contact Resistance: 30mR; Voltage Rating: 50V; Gender: Male; Insulation Resistance: 500MR; Panel Thickness: 3.5mm; Supplier 1: Digi-Key; RoHS: Yes; Category: Headers and Wire Housings; Stock 1: 14808; Mount: Through Hole; Number of Pins: 6; Color: White; Contact Plating: Tin,Copper; Contact Material: Brass,Tin,Copper; Housing Color: Beige; Housing Material: Polyamide; Material: Nylon; Contact Shape: Circular; Insulation Material: Nylon; Insulation Color: Natural; Min Operating Temperature: -25°C; Max Operating Temperature: 85°C; Number of Rows: 1; Packaging: Bulk; Termination: Solder; Fastening Type: Detent; Number of Contacts: 6; Max Voltage Rating (AC): 50V; Max Current Rating: 1A; Orientation: Right Angle; Voltage Rating (AC): 50V; Voltage Rating (DC): 50V; Length: 10.5mm; Width: 3.5mm; Height: 7.2mm; Pitch: 1.5mm; Depth: 6mm; Lead Pitch: 1.5mm; Contact Mating Length: 0.094inch; Lead Free: Lead Free; Flammability Rating: UL94 V-0; REACH SVHC: No SVHC; ComponentLink1URL: https://datasheet.ciiva.com/8052/80556-8052225.pdf?src-supplier=Element14; ComponentLink1Description: https://datasheet.ciiva.com/8052/80556-8052225.pdf?src-supplier=Element14; ComponentLink2URL: https://datasheet.ciiva.com/25617/0900766b81147f94-25617345.pdf?src-supplier=RSComponents; ComponentLink2Description: https://datasheet.ciiva.com/25617/0900766b81147f94-25617345.pdf?src-supplier=RSComponents; ComponentLink3URL: https://datasheet.ciiva.com/11752/0900766b8082f593-11752194.pdf?src-supplier=RSComponents; ComponentLink3Description: https://datasheet.ciiva.com/11752/0900766b8082f593-11752194.pdf?src-supplier=RSComponents; ComponentLink4URL: https://datasheet.ciiva.com/26894/getdatasheetpartid-642095-26894637.pdf?src-supplier=Verical; ComponentLink4Description: https://datasheet.ciiva.com/26894/getdatasheetpartid-642095-26894637.pdf?src-supplier=Verical; ComponentLink5URL: https://datasheet.ciiva.com/712/ezh-712560.pdf?src-supplier=Digi-Key; ComponentLink5Description: https://datasheet.ciiva.com/712/ezh-712560.pdf?src-supplier=Digi-Key; ComponentLink6URL: https://datasheet.ciiva.com/16484/s6b-zrlfsn-16484554.pdf?src-supplier=Future+Electronics; ComponentLink6Description: https://datasheet.ciiva.com/16484/s6b-zrlfsn-16484554.pdf?src-supplier=Future+Electronics; Supplier Part Number 1: 455-1673-ND
R2-R5 R9 R11 R15 R17 R21 R23 R27 R29 R36 R40 R42 R46 R48 R52 R54 R57 = RES 100k 1/8W - 1%: RES SMD 100K OHM 1% 1/8W 0805; Power (Watts): 0.125W; Package: 0805; Value: 100k; Tolerance: 1%
R6 R7 R18 R19 R30-R34 R37 R44 R49 R58-R61 = RES 64.9k 1/8W: RES SMD 64.9K OHM 1% 1/8W 0805; Power (Watts): 0.125W; Package: 0805; Value: 64.9k; Tolerance: 1%; ComponentLink1Description: digikey; ComponentLink1URL: https://www.digikey.ca/en/products/detail/yageo/RC0805FR-0764K9L/728090
R8 R10 R12-R14 R16 R20 R22 R24-R26 R28 R35 R38 R39 R41 R43 R45 R47 R50 R51 R53 R55 R56 = RES 330.0 1/8W - 1%: RES SMD 330 OHM 1% 1/8W 0805; Rating: 0.125W; Package: 0805; Value: 330; Tolerance: 1%
U2 U3 = OP AMP SINGLE: ANALOG DEVICES - ADA4505-1ARJZ-R7 - IC, AMPLIF. OPER., R-R, CMOS, SOT23-5; Min Supply Voltage: 1.8V; Max Supply Voltage: 5V; Min Dual Supply Voltage: 900mV; Max Dual Supply Voltage: 2.5V; Voltage Gain: 120dB; Common Mode Rejection Ratio: 105dB; Gain Bandwidth Product: 50kHz; Slew Rate: 0.006V/µs; Operating Supply Voltage: 3V; Number of Circuits: 1; Input Bias Current: 500nA; Input Offset Voltage (Vos): 3mV; Operating Supply Current: 9uA; Output Current per Channel: 40mA; Power Supply Rejection Ratio (PSRR): 110dB; Input Capacitance: 4.7pF; Supplier 1: Digi-Key; Manufacturer: Analog Devices; Manufacturer Part Number: ADA4505-1ARJZ-R7; RoHS: Yes; Category: Amplifiers - Op Amps, Buffer, Instrumentation; Stock 1: 3416; Case/Package: SOT-23-5; Number of Pins: 5; Contact Plating: Tin,Matte; Min Operating Temperature: -40°C; Max Operating Temperature: 125°C; Bandwidth: 50kHz; Packaging: Tape and Reel; Package Quantity: 3000; Unity Gain Bandwidth Product: 50kHz; Number of Channels: 1; Number of Elements: 1; Number of Amplifiers: 1; Quiescent Current: 9uA; REACH SVHC: No SVHC; Lead Free: Contains Lead; ComponentLink1URL: https://datasheet.ciiva.com/22712/1610797-22712032.pdf?src-supplier=Element14; ComponentLink1Description: https://datasheet.ciiva.com/22712/1610797-22712032.pdf?src-supplier=Element14; ComponentLink2URL: https://datasheet.ciiva.com/23805/608874-23805844.pdf?src-supplier=Newark; ComponentLink2Description: https://datasheet.ciiva.com/23805/608874-23805844.pdf?src-supplier=Newark; ComponentLink3URL: https://datasheet.ciiva.com/1487/1610797-1487372.pdf?src-supplier=Element14; ComponentLink3Description: https://datasheet.ciiva.com/1487/1610797-1487372.pdf?src-supplier=Element14; Digikey: ADA4505-1ARJZ-R7CT-ND
U4-U7 = OP AMP DUAL: IC OPAMP VFB 50KHZ RRO 8MSOP; Manufacturer: Analog Devices; Manufacturer Part Number: ADA4505-2ARMZ; Common Mode Rejection Ratio: 105dB; Max Supply Voltage: 5V; Min Supply Voltage: 1.8V; Max Dual Supply Voltage: 2.5V; Min Dual Supply Voltage: 900mV; Voltage Gain: 120dB; Operating Supply Voltage: 3V; Slew Rate: 0.006V/µs; Input Offset Voltage (Vos): 3mV; Input Bias Current: 0.5pA; Operating Supply Current: 14uA; Number of Channels: 2; Power Supply Rejection Ratio (PSRR): 110dB; Output Current per Channel: 40mA; Quiescent Current: 7uA; Input Capacitance: 4.7pF; Supply Type: Single,Dual; RoHS: Yes; Category: Amplifiers - Op Amps, Buffer, Instrumentation; Stock 1: 767; Case/Package: MSOP; Number of Pins: 8; Contact Plating: Tin,Matte; Min Operating Temperature: -40°C; Max Operating Temperature: 125°C; Gain Bandwidth Product: 50kHz; Packaging: Rail/Tube; Package Quantity: 50; Unity Gain Bandwidth Product: 50kHz; Number of Circuits: 2; Number of Elements: 2; Number of Amplifiers: 2; Max Input Voltage: 5V; Nominal Supply Current: 7uA; Bandwidth: 50kHz; Length: 3.2mm; Width: 3.2mm; Height: 0.95mm; Lead Free: Contains Lead; REACH SVHC: No SVHC; ComponentLink1URL: https://datasheet.ciiva.com/24017/ada4505-1-4505-2-4505-4-249280-24017665.pdf?src-supplier=Mouser; ComponentLink1Description: https://datasheet.ciiva.com/24017/ada4505-1-4505-2-4505-4-249280-24017665.pdf?src-supplier=Mouser; ComponentLink2URL: https://datasheet.ciiva.com/2974/ada4505-1-4505-2-4505-4-2974772.pdf?src-supplier=Avnet; ComponentLink2Description: https://datasheet.ciiva.com/2974/ada4505-1-4505-2-4505-4-2974772.pdf?src-supplier=Avnet; ComponentLink3URL: https://datasheet.ciiva.com/17569/ada4505-1-4505-2-4505-4-17569270.pdf?src-supplier=Avnet+Europe; ComponentLink3Description: https://datasheet.ciiva.com/17569/ada4505-1-4505-2-4505-4-17569270.pdf?src-supplier=Avnet+Europe; ComponentLink4URL: https://datasheet.ciiva.com/1805/ada4505-1-4505-2-4505-4-1805784.pdf?src-supplier=Digi-Key; ComponentLink4Description: https://datasheet.ciiva.com/1805/ada4505-1-4505-2-4505-4-1805784.pdf?src-supplier=Digi-Key; Digikey: ADA4505-2ARMZ-ND

## Sheet Mainboard_Power_Interface.SchDoc
size A4
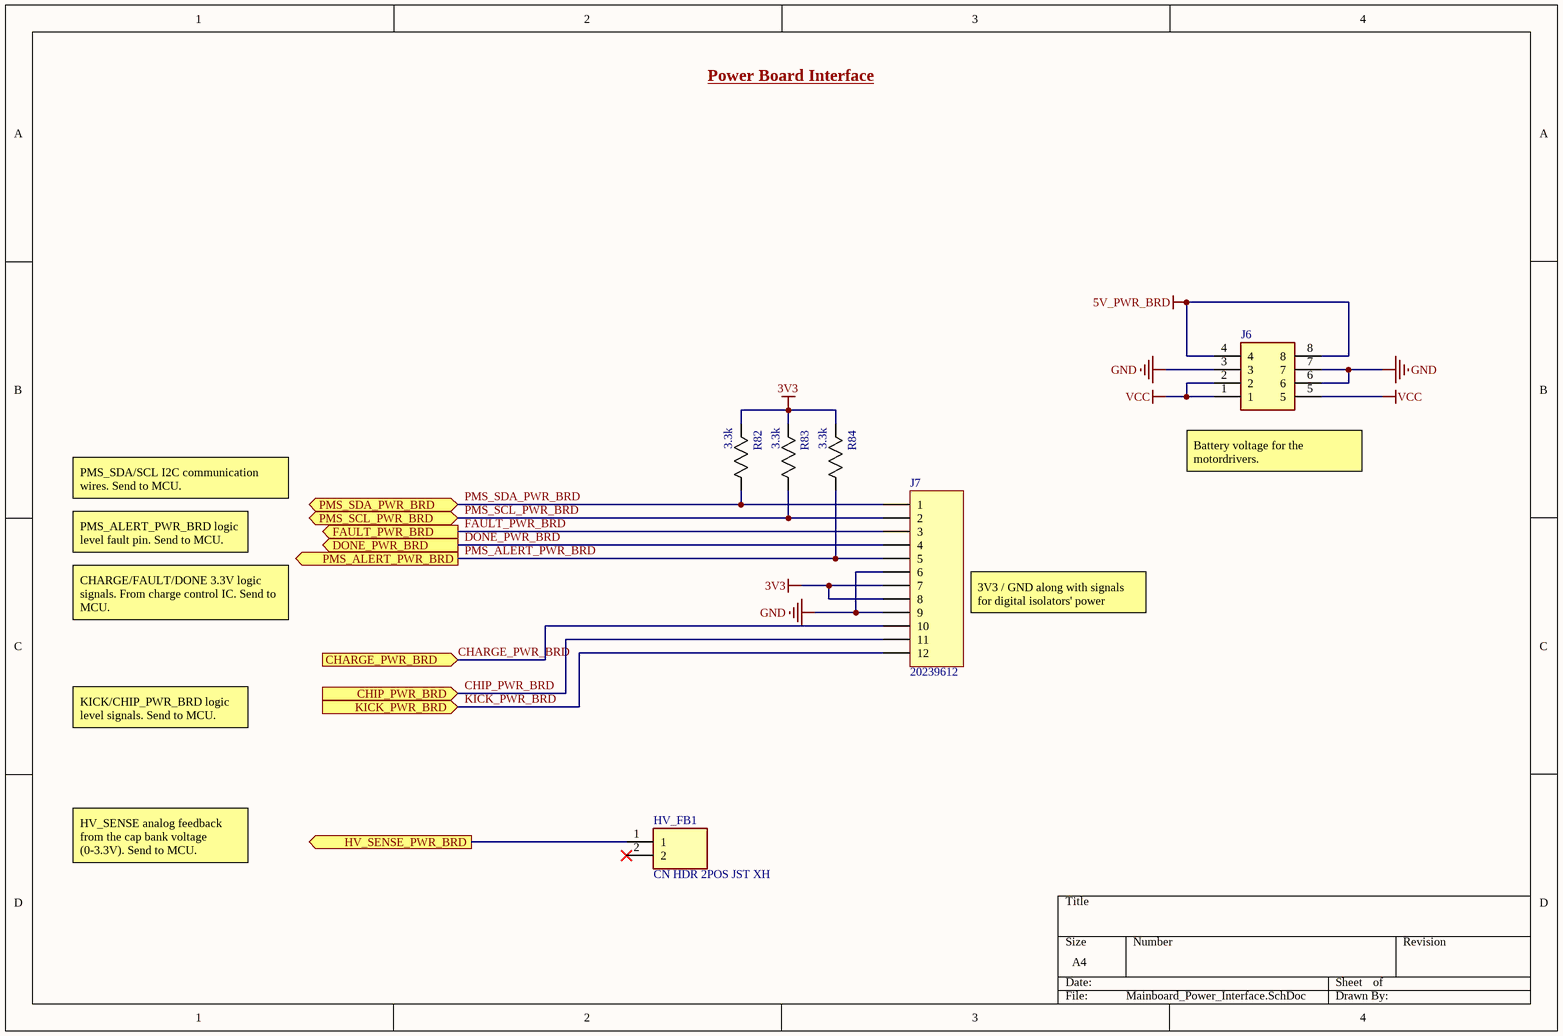
[diagram p2: Mainboard_Power_Interface.SchDoc]

### Parts
HV_FB1  CN HDR 2POS JST XH  [JST_B2B-XH-A(LF)(SN)]
J6  CN HDR 8POS Molex 43045-0812 (R)  [4304508]  (value not drawn)
J7  20239612  [CN 20355612]
R82  3.3k  [0603]
R83  3.3k  [0603]
R84  3.3k  [0603]

### Ports
CHARGE_PWR_BRD (in), CHIP_PWR_BRD (in), DONE_PWR_BRD (out), FAULT_PWR_BRD (out), HV_SENSE_PWR_BRD (out), KICK_PWR_BRD (in), PMS_ALERT_PWR_BRD (out), PMS_SCL_PWR_BRD (bidir), PMS_SDA_PWR_BRD (bidir)

### Nets
3V3: J7.7 J7.8 R82.2(R2) R83.2(R2) R84.2(R2)
5V_PWR_BRD: J6.4 J6.8
GND: J6.3 J6.6 J6.7 J7.6 J7.9
VCC: J6.1 J6.2 J6.5
CHARGE_PWR_BRD: J7.10 ; port CHARGE_PWR_BRD
CHIP_PWR_BRD: J7.11 ; port CHIP_PWR_BRD
DONE_PWR_BRD: J7.4 ; port DONE_PWR_BRD
FAULT_PWR_BRD: J7.3 ; port FAULT_PWR_BRD
KICK_PWR_BRD: J7.12 ; port KICK_PWR_BRD
PMS_ALERT_PWR_BRD: J7.5 R84.1(R1) ; port PMS_ALERT_PWR_BRD
PMS_SCL_PWR_BRD: J7.2 R83.1(R1) ; port PMS_SCL_PWR_BRD
PMS_SDA_PWR_BRD: J7.1 R82.1(R1) ; port PMS_SDA_PWR_BRD
NetHV_FB1_1: HV_FB1.1 ; port HV_SENSE_PWR_BRD

Not connected (* = marked no-connect by the designer): HV_FB1 2*

### Notes on the sheet
- Power Board Interface
- PMS_SDA/SCL I2C communication wires. Send to MCU.
- (near J6) Battery voltage for the motordrivers.
- PMS_ALERT_PWR_BRD logic level fault pin. Send to MCU.
- CHARGE/FAULT/DONE 3.3V logic signals. From charge control IC. Send to MCU.
- 3V3 / GND along with signals for digital isolators' power
- KICK/CHIP_PWR_BRD logic level signals. Send to MCU.
- HV_SENSE analog feedback from the cap bank voltage (0-3.3V). Send to MCU.

### Library data of the parts
HV_FB1 = CN HDR 2POS JST XH: Connector Header Through Hole 2 position 0.098 _2.50mm_ / JST XH; MP: B2B-XH-A_LF__SN_; MF: JST Sales; Price: None; Package: None; Value: *; Availability: Unavailable; SnapEDA_Link: https://www.snapeda.com/parts/B2B-XH-A%28LF%29%28SN%29/JST%20Sales%20America%20Inc./view-part/492310/?ref=snap
J6 = CN HDR 8POS Molex 43045-0812 (R): Molex 43045-0812 8POS Microfit / DR TH Vertical
J7 = CN Pico Clasp 12POS: 12 POS Right Angle Pico Clasp Surface Mount
R82-R84 = RES 3.3k 1/8W: RES SMD 3.3K OHM 5% 1/8W 0805; Power (Watts): 0.125W; Package: 0805; Value: 3.3k; Tolerance: 5%

## Sheet Mainboard_RMII_Interface.SchDoc
size B
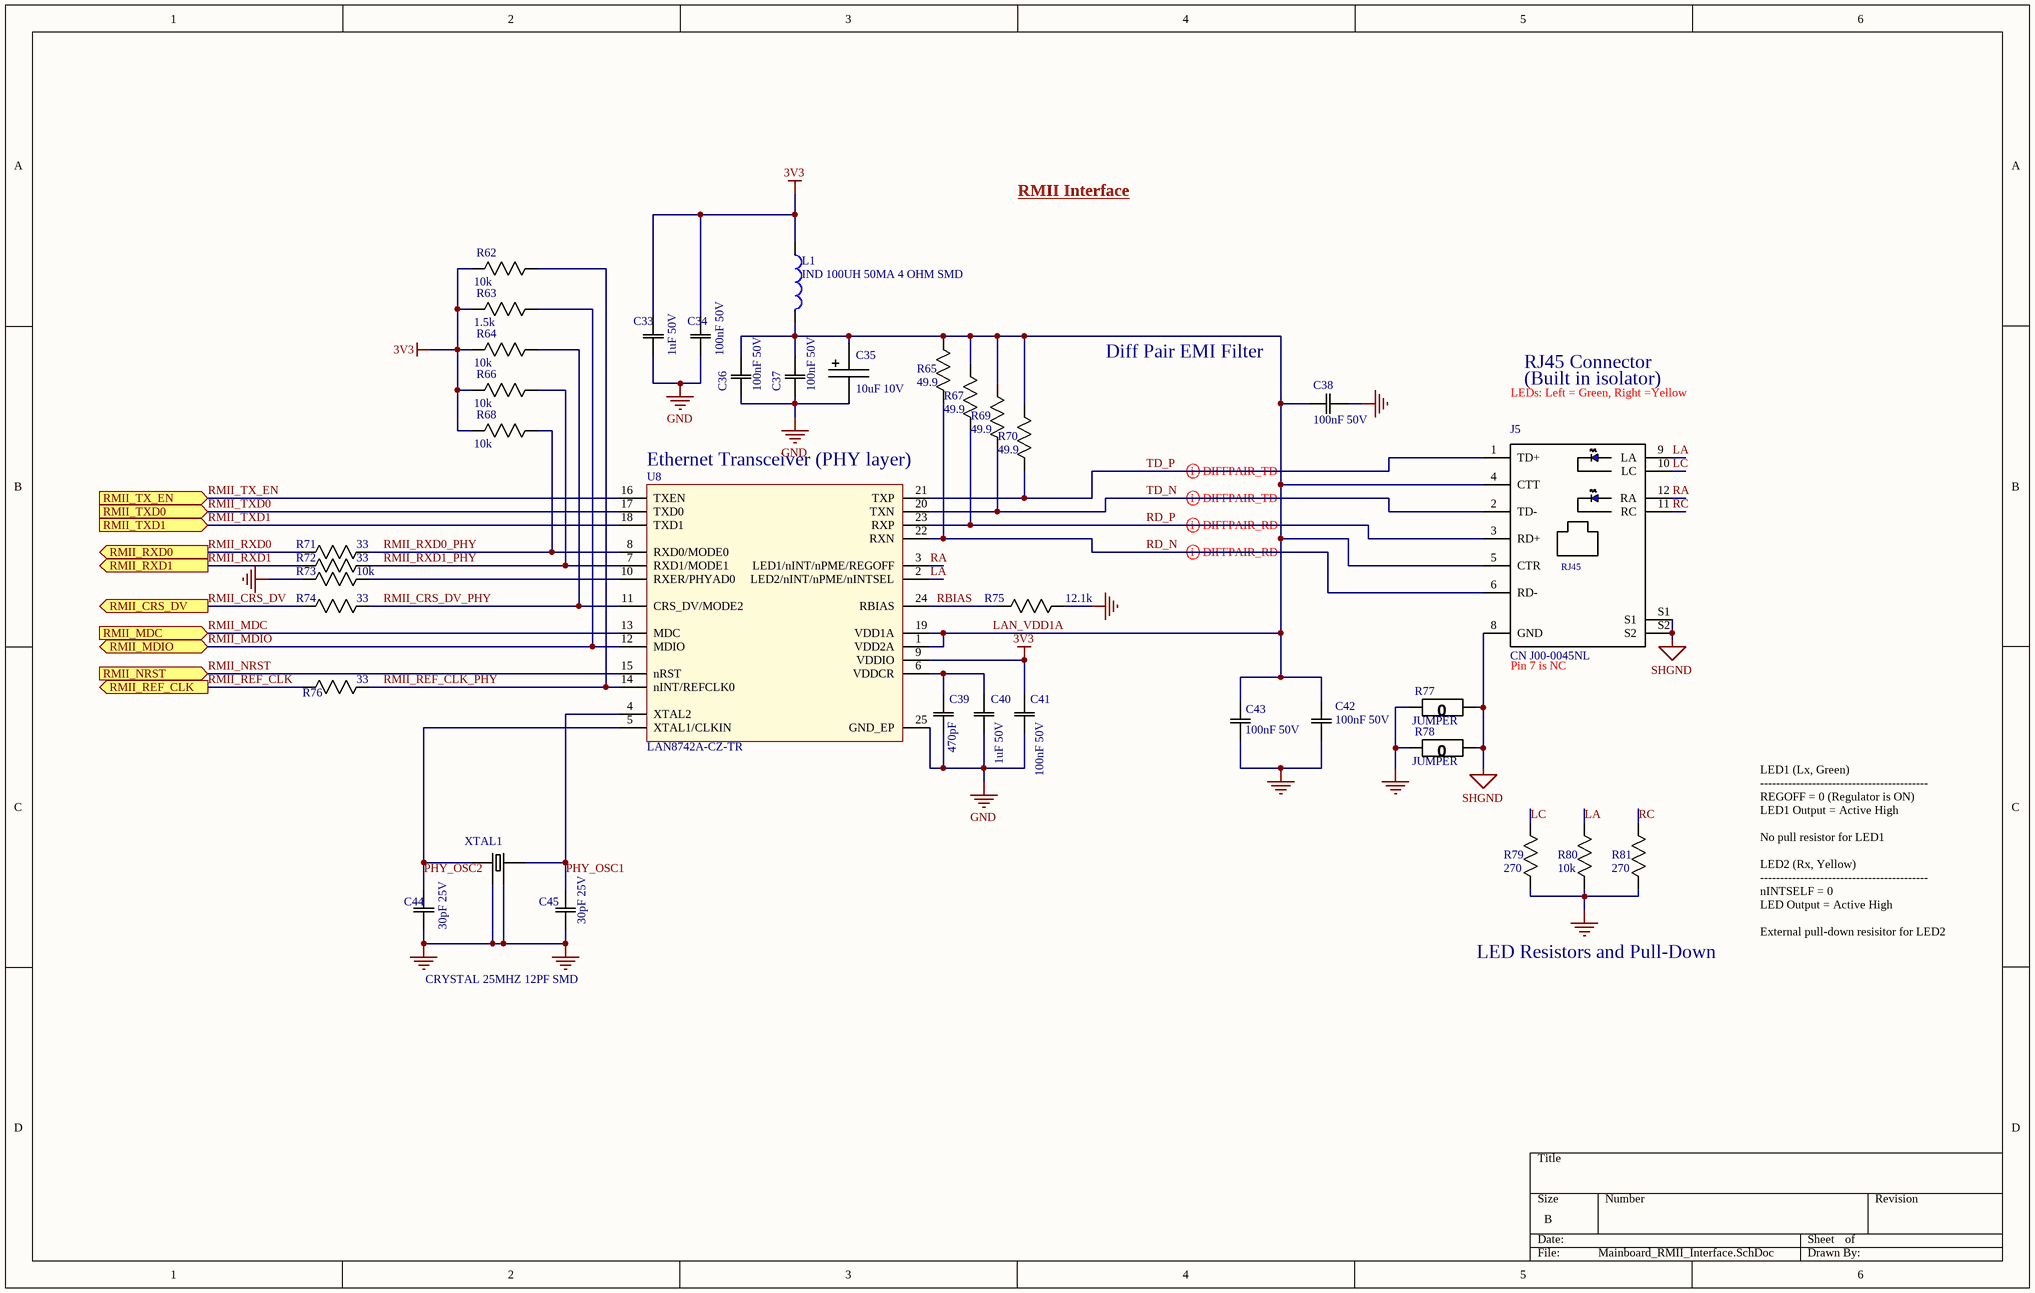
[diagram p3: Mainboard_RMII_Interface.SchDoc]

### Parts
C33  1uF 50V  [0603]
C34  100nF 50V  [0603]
C35  10uF 10V  [1206 Polarized]
C36  100nF 50V  [0603]
C37  100nF 50V  [0603]
C38  100nF 50V  [0603]
C39  470pF  [0603]
C40  1uF 50V  [0603]
C41  100nF 50V  [0603]
C42  100nF 50V  [0603]
C43  100nF 50V  [0603]
C44  30pF 25V  [0603]
C45  30pF 25V  [0603]
J5  CN J00-0045NL  [RJ45 J00-0045NL]
L1  IND 100UH 50MA 4 OHM SMD  [0805]
R62  10k  [0603]
R63  1.5k  [0603]
R64  10k  [0603]
R65  49.9  [0603]
R66  10k  [0603]
R67  49.9  [0603]
R68  10k  [0603]
R69  49.9  [0603]
R70  49.9  [0603]
R71  33  [0603]
R72  33  [0603]
R73  10k  [0603]
R74  33  [0603]
R75  12.1k  [0603]
R76  33  [0603]
R77  JUMPER  [0603]
R78  JUMPER  [0603]
R79  270  [0603]
R80  10k  [0603]
R81  270  [0603]
U8  LAN8742A-CZ-TR  [24-QFN (4x4)]
XTAL1  CRYSTAL 25MHZ 12PF SMD  [3225-4SMD]

### Ports
RMII_CRS_DV (out), RMII_MDC (in), RMII_MDIO (bidir), RMII_NRST (in), RMII_REF_CLK (out), RMII_RXD0 (out), RMII_RXD1 (out), RMII_TX_EN (in), RMII_TXD0 (in), RMII_TXD1 (in)

### Nets
3V3: C33.2(C2) C34.2(C2) C41.2(C2) L1.1 R62.2(R2) R63.2(R2) R64.2(R2) R66.2(R2) R68.2(R2) U8.9(VDDIO)
GND: C33.1(C1) C34.1(C1) C35.2(P$2) C36.1(C1) C37.1(C1) C38.2(C2) C39.1(C1) C40.1(C1) C41.1(C1) C42.1(C1) C43.1(C1) C44.1(C1) C45.1(C1) R73.2(R2) R75.1(R1) R77.2(R2) R78.2(R2) R79.2(R2) R80.2(R2) R81.2(R2) U8.25(GND_EP) XTAL1.2 XTAL1.4
SHGND: J5.8(GND) J5.S1 J5.S2 R77.1(R1) R78.1(R1)
LA: J5.9(LA) R80.1(R1) U8.2(LED2/nINT/nPME/nINTSEL)
LAN_VDD1A: C35.1(P$1) C36.2(C2) C37.2(C2) C38.1(C1) C42.2(C2) C43.2(C2) J5.4(CTT) J5.5(CTR) L1.2 R65.1(R1) R67.1(R1) R69.1(R1) R70.1(R1) U8.1(VDD2A) U8.19(VDD1A)
LC: J5.10(LC) R79.1(R1)
PHY_OSC1: C45.2(C2) U8.4(XTAL2) XTAL1.3
PHY_OSC2: C44.2(C2) U8.5(XTAL1/CLKIN) XTAL1.1
RA: J5.12(RA) U8.3(LED1/nINT/nPME/REGOFF)
RBIAS: R75.2(R2) U8.24(RBIAS)
RC: J5.11(RC) R81.1(R1)
RD_N: J5.6(RD-) R65.2(R2) U8.22(RXN)
RD_P: J5.3(RD+) R67.2(R2) U8.23(RXP)
RMII_CRS_DV: R74.2(R2) ; port RMII_CRS_DV
RMII_CRS_DV_PHY: R64.1(R1) R74.1(R1) U8.11(CRS_DV/MODE2)
RMII_MDC: U8.13(MDC) ; port RMII_MDC
RMII_MDIO: R63.1(R1) U8.12(MDIO) ; port RMII_MDIO
RMII_NRST: U8.15(nRST) ; port RMII_NRST  [project net NRST]
RMII_REF_CLK: R76.2(R2) ; port RMII_REF_CLK
RMII_REF_CLK_PHY: R62.1(R1) R76.1(R1) U8.14(nINT/REFCLK0)
RMII_RXD0: R71.2(R2) ; port RMII_RXD0
RMII_RXD0_PHY: R68.1(R1) R71.1(R1) U8.8(RXD0/MODE0)
RMII_RXD1: R72.2(R2) ; port RMII_RXD1
RMII_RXD1_PHY: R66.1(R1) R72.1(R1) U8.7(RXD1/MODE1)
RMII_TX_EN: U8.16(TXEN) ; port RMII_TX_EN
RMII_TXD0: U8.17(TXD0) ; port RMII_TXD0
RMII_TXD1: U8.18(TXD1) ; port RMII_TXD1
TD_N: J5.2(TD-) R69.2(R2) U8.20(TXN)
TD_P: J5.1(TD+) R70.2(R2) U8.21(TXP)
NetC39_2: C39.2(C2) C40.2(C2) U8.6(VDDCR)
NetR73_1: R73.1(R1) U8.10(RXER/PHYAD0)

### Layout directives
differential pair: RD_N, RD_P, TD_N, TD_P

### Notes on the sheet
- RMII Interface
- (near C38) Diff Pair EMI Filter
- RJ45 Connector
- LEDs: Left = Green, Right =Yellow
- (Built in isolator)
- Ethernet Transceiver (PHY layer)
- (near J5) Pin 7 is NC
- LED Resistors and Pull-Down
- LED1 (Lx, Green)
  ------------------------------------------
  REGOFF = 0 (Regulator is ON)
  LED1 Output = Active High
  No pull resistor for LED1
  LED2 (Rx, Yellow)
  ------------------------------------------
  nINTSELF = 0
  LED Output = Active High
  External pull-down resisitor for LED2
- (in symbol CN MAGJACK) RJ45

### Library data of the parts
C33 C40 = CAP 1uF 50V: CAP CER 1UF 50V X7R 0805; Tolerance: 10%; Package: 0805; Value: 1uF; Rating: 50V; Temperature Coefficient: X7R; Operating Temperature: -55°C ~ 125°C
C34 C36-C38 C41-C43 = CAP 100nF 50V: as C11 on sheet Mainboard_Encoder_Interface; Package: 0805; Value: 100nF; Rating: 50V
C35 = CAP TANT 10uF 10V: CAP TANT 10UF 10V 1206; Tolerance: 10%; ESR (Equivalent Series Resistance): 3.8 Ohm; Type: Molded Tantalum; Package: 1206; Value: 10uF; Rating: 10V; Operating Temperature: -55°C ~ 125°C
C39 = CAP 470pF 50V: CAP CER 470PF 50V X7R 0603/0805; Tolerance: 10%; Package: 0603/0805; Value: 470pF; Rating: 50V; Temperature Coefficient: X7R; Operating Temperature: -55°C ~ 125°C
C44 C45 = CAP 30pF 25V: CAP CER 30PF 25V NP0 0805; Tolerance: 20%; Package: 0805; Value: 30pF; Rating: 25V
J5 = CN MAGJACK: CN MAGJACK 1PORT 100 BASE-TX; MF: Pulse Electronics; Package: None; SnapEDA_Link: https://www.snapeda.com/parts/J00-0045NL/Pulse%20Electronics%20Network/view-part/87956/?ref=snap; MP: J00-0045NL; Value: *; Digikey Link: https://www.digikey.com/product-detail/en/pulse-electronics-network/J00-0045NL/553-1619-5-ND/1036860?utm_source=snapeda&utm_medium=aggregator&utm_campaign=symbol; Digikey: 553-1619-5-ND; Supplier 1: Mouser; Supplier Part Number 1: 673-J00-0045NL
L1 = IND 100UH 50MA 4 OHM SMD: 100µH Unshielded Wirewound Inductor 50mA 4Ohm 0805 (2012 Metric); MF: Taiyo Yuden; MP: LBR2012T101K; Revision: July-2002: Re-released for DXP Platform.; Value: 100uH; Digikey: 587-2048-1-ND; Digikey Link: https://www.digikey.ca/product-detail/en/taiyo-yuden/LBR2012T101K/587-2048-1-ND/1788995; Supplier 1: Digi-Key; Supplier Part Number 1: 587-4040-1-ND
R62 R64 R66 R68 R73 R80 = RES 10k 1/8W - 1%: RES SMD 10K OHM 1% 1/8W 0805; Power (Watts): 0.125W; Package: 0805; Value: 10k; Tolerance: 1%
R63 = RES 1.5k 1/8W - 1%: RES SMD 1.5K OHM 1% 1/8W 0805; Power (Watts): 0.125W; Package: 0805; Value: 1.5k; Tolerance: 1%; ComponentLink1Description: digikey; ComponentLink1URL: https://www.digikey.ca/en/products/detail/panasonic-electronic-components/ERJ-6ENF1022V/111476
R65 R67 R69 R70 = RES 49.9 1/8W: RES SMD 49.9 OHM 1% 1/8W 0805; Power (Watts): 0.125W; Package: 0805; Value: 49.9; Tolerance: 1%
R71 R72 R74 R76 = RES 33.0 1/8W - 1%: RES SMD 33 OHM 1% 1/8W 0805; Power (Watts): 0.125W; Package: 0805; Value: 33; Tolerance: 1%
R75 = RES 12.1k 1/8W: RES SMD 12.1K OHM 1% 1/8W 0805; Power (Watts): 0.125W; Package: 0805; Value: 12.1k; Tolerance: 1%
R77 R78 = RES 0 JUMPER: RES SMD 0 OHM JUMPER GENERIC 0805; Value: 0; Package: 0805
R79 R81 = RES 270.0 1/8W: RES SMD 270 OHM 5% 1/8W 0805; Power (Watts): 0.125W; Package: 0805; Value: 270; Tolerance: 5%
U8 = LAN8742A-CZ-TR: LAN8742A-CZ-TR - Small Footprint RMII 10/100 Ethernet, Transceiver with HP Auto-MDIX and flexPWR Technology SQFN-24; MF: Microchip Technology; MP: LAN8742A-CZ-TR; Digikey: LAN8742A-CZ-CT-ND; Digikey Link: https://www.digikey.ca/product-detail/en/microchip-technology/LAN8742A-CZ-TR/LAN8742A-CZ-CT-ND/8256089; Supplier 1: Digi-Key; Supplier Part Number 1: LAN8742A-CZ-CT-ND
XTAL1 = XTAL 25MHZ 12PF SMD4: 25MHz ±10ppm Crystal 12pF 40 Ohms 2-SMD, No Lead; MP: X322525MOB4SI; MF: Yangxing Tech; ESR: 70 Ohms; Package: 2-SMD, No Lead; Frequency: 25MHz; Load Capacitance: 12pF; Supplier 1: Digi-Key

## Sheet Mainboard_Wifi_Interface.SchDoc
size A4
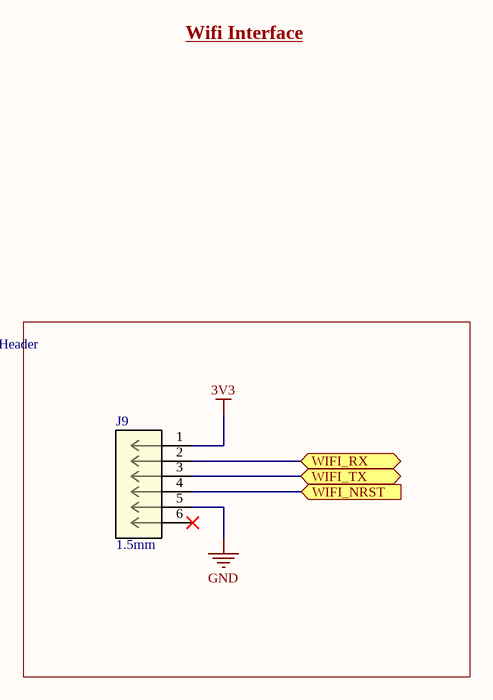
[diagram p4: Mainboard_Wifi_Interface.SchDoc]

### Parts
J9  1.5mm  [6POS JST Vertical]

### Blocks framed on the sheet
Wifi Interface Header: J9

### Ports
WIFI_NRST (in), WIFI_RX (bidir), WIFI_TX (bidir)

### Nets
3V3: J9.1
GND: J9.5
NetJ9_2: J9.2 ; port WIFI_RX
NetJ9_3: J9.3 ; port WIFI_TX
NetJ9_4: J9.4 ; port WIFI_NRST

Not connected (* = marked no-connect by the designer): J9 6*

### Notes on the sheet
- Wifi Interface

### Library data of the parts
J9 = CN 6POS JST RA: as J1 on sheet Mainboard_Encoder_Interface; Supplier 1: Digi-Key; RoHS: Yes; Category: Headers and Wire Housings; Stock 1: 14808; Mount: Through Hole; Number of Pins: 6; Color: White; Contact Plating: Tin,Copper; Contact Material: Brass,Tin,Copper; Housing Color: Beige; Housing Material: Polyamide; Material: Nylon; Contact Shape: Circular; Insulation Material: Nylon; Insulation Color: Natural; Min Operating Temperature: -25°C; Max Operating Temperature: 85°C; Number of Rows: 1; Packaging: Bulk; Termination: Solder; Fastening Type: Detent; Number of Contacts: 6; Max Voltage Rating (AC): 50V; Max Current Rating: 1A; Orientation: Right Angle; Voltage Rating (AC): 50V; Voltage Rating (DC): 50V; Length: 10.5mm; Width: 3.5mm; Height: 7.2mm; Pitch: 1.5mm; Depth: 6mm; Lead Pitch: 1.5mm; Contact Mating Length: 0.094inch; Lead Free: Lead Free; Flammability Rating: UL94 V-0; REACH SVHC: No SVHC; ComponentLink1URL: https://datasheet.ciiva.com/8052/80556-8052225.pdf?src-supplier=Element14; ComponentLink1Description: https://datasheet.ciiva.com/8052/80556-8052225.pdf?src-supplier=Element14; ComponentLink2URL: https://datasheet.ciiva.com/25617/0900766b81147f94-25617345.pdf?src-supplier=RSComponents; ComponentLink2Description: https://datasheet.ciiva.com/25617/0900766b81147f94-25617345.pdf?src-supplier=RSComponents; ComponentLink3URL: https://datasheet.ciiva.com/11752/0900766b8082f593-11752194.pdf?src-supplier=RSComponents; ComponentLink3Description: https://datasheet.ciiva.com/11752/0900766b8082f593-11752194.pdf?src-supplier=RSComponents; ComponentLink4URL: https://datasheet.ciiva.com/26894/getdatasheetpartid-642095-26894637.pdf?src-supplier=Verical; ComponentLink4Description: https://datasheet.ciiva.com/26894/getdatasheetpartid-642095-26894637.pdf?src-supplier=Verical; ComponentLink5URL: https://datasheet.ciiva.com/712/ezh-712560.pdf?src-supplier=Digi-Key; ComponentLink5Description: https://datasheet.ciiva.com/712/ezh-712560.pdf?src-supplier=Digi-Key; ComponentLink6URL: https://datasheet.ciiva.com/16484/s6b-zrlfsn-16484554.pdf?src-supplier=Future+Electronics; ComponentLink6Description: https://datasheet.ciiva.com/16484/s6b-zrlfsn-16484554.pdf?src-supplier=Future+Electronics; Supplier Part Number 1: 455-1673-ND

## Sheet Mainboard_Breakbeam_Interface.SchDoc
size A4
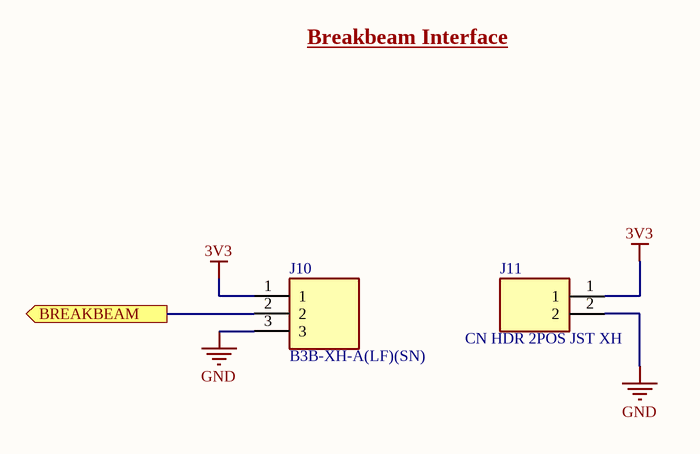
[diagram p5: Mainboard_Breakbeam_Interface.SchDoc]

### Parts
J10  B3B-XH-A(LF)(SN)  [JST_B3B-XH-A(LF)(SN)]
J11  CN HDR 2POS JST XH  [JST_B2B-XH-A(LF)(SN)]

### Ports
BREAKBEAM (out)

### Nets
3V3: J10.1 J11.1
GND: J10.3 J11.2
BREAKBEAM: J10.2 ; port BREAKBEAM

### Notes on the sheet
- Breakbeam Interface

### Library data of the parts
J10 = CN 3POS TH JSTXH: CN 3POS TH JST XH; MF: JST Sales; Package: None; SnapEDA_Link: https://www.snapeda.com/parts/B3B-XH-A(LF)(SN)/JST%20Sales%20America%20Inc./view-part/231271/?ref=snap; DigiKey-Purchase-URL: https://snapeda.com/shop?store=DigiKey&id=231271; MP: B3B-XH-A(LF)(SN); Price: None; Availability: Warning; Value: *
J11 = CN HDR 2POS JST XH: as HV_FB1 on sheet Mainboard_Power_Interface; Price: None; Package: None; Value: *; Availability: Unavailable; SnapEDA_Link: https://www.snapeda.com/parts/B2B-XH-A%28LF%29%28SN%29/JST%20Sales%20America%20Inc./view-part/492310/?ref=snap

## Sheet MainBoard_MCU_Power.SchDoc
size B
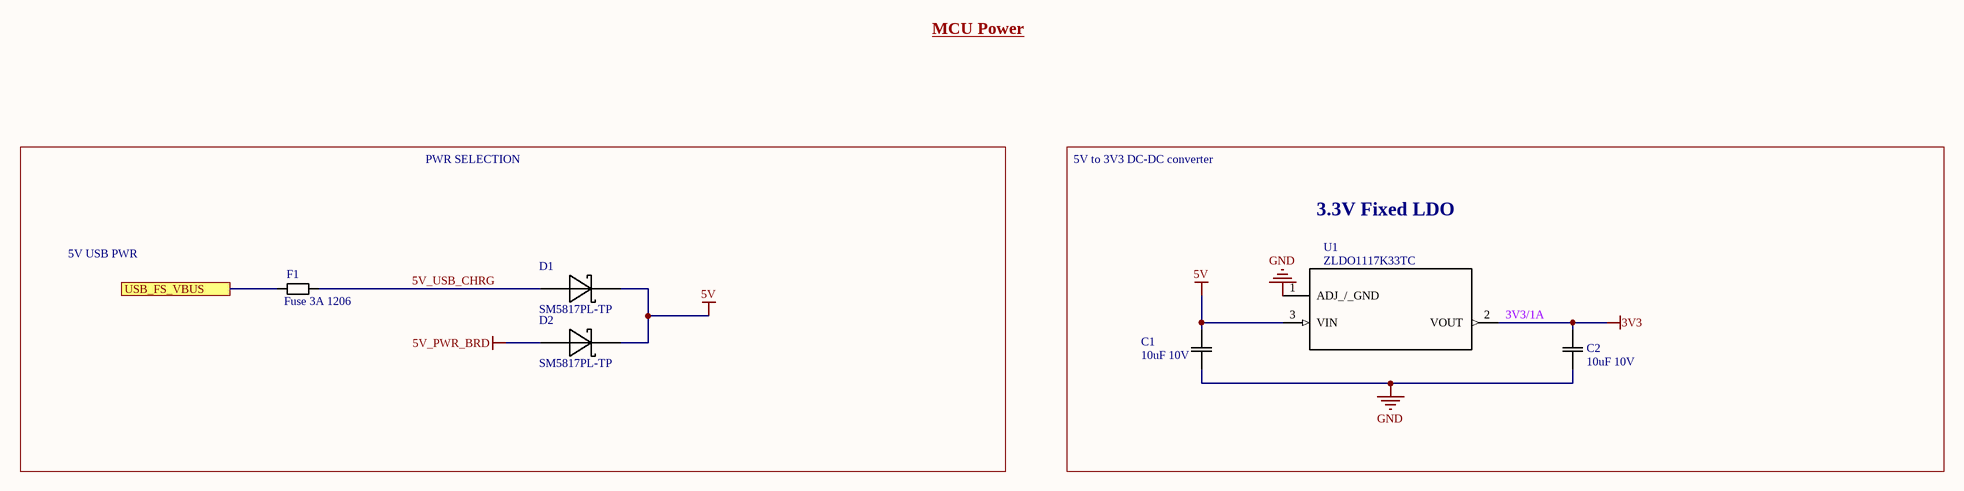
[diagram p6: MainBoard_MCU_Power.SchDoc]

### Parts
C1  10uF 10V  [0603]
C2  10uF 10V  [0603]
D1  SM5817PL-TP  [SOD-123]
D2  SM5817PL-TP  [SOD-123]
F1  Fuse 3A 1206  [1206]
U1  ZLDO1117K33TC  [DPAK (TO-252)]

### Blocks framed on the sheet
3.3V Fixed LDO: C1 C2 U1

### Ports
USB_FS_VBUS

### Nets
3V3: C2.1(C1) U1.2(VOUT)
5V: C1.1(C1) D1.C(K) D2.C(K) U1.3(VIN)
5V_PWR_BRD: D2.A
GND: C1.2(C2) C2.2(C2) U1.1(ADJ_/_GND)
5V_USB_CHRG: D1.A F1.2
NetF1_1: F1.1 ; port USB_FS_VBUS

### Notes on the sheet
- MCU Power
- PWR SELECTION
- 5V to 3V3 DC-DC converter
- 5V USB PWR
- 3V3/1A

### Library data of the parts
C1 C2 = CAP 10uF 10V: CAP CER 10UF 10V X5R 0805; Tolerance: 10%; Package: 0805; Value: 10uF; Rating: 10V
D1 D2 = DIODE SCHOTTKY 20V 1A: Diode Schottky 20V 1A Surface Mount SOD-123FL; MF: Micro Commercial Co; ComponentLink1Description: digikey; ComponentLink1URL: https://www.digikey.ca/product-detail/en/on-semiconductor/MBR0540T1G/MBR0540T1GOSCT-ND/917967; Digikey: SM5817PL-TPMSCT-ND; Digikey Link: https://www.digikey.ca/product-detail/en/micro-commercial-co/SM5817PL-TP/SM5817PL-TPMSCT-ND/1793410; MP: SM5817PL-TP; Voltage Rating: 20V; Package: SOD-123; Current Rating: 1A
F1 = FUSE 3A 63V SLOW: FUSE 3A 63V AC/DC SLOW 1206; Response Time: Slow Blow; Current Rating (Amps): 3A; Operating Temperature: -55°C ~ 90°C; Voltage Rating - AC: 63V; Voltage Rating - DC: 63V
U1 = ZLDO1117K33TC: Linear Voltage Regulator IC Positive Fixed 1 Output  1A TO-252-3; MF: Diodes Incorporated; Package: TO-252-3; MP: ZLDO1117K33TC; Digikey: ZLDO1117K33DIDKR-ND; Digikey Link: https://www.digikey.ca/product-detail/en/diodes-incorporated/ZLDO1117K33TC/ZLDO1117K33DIDKR-ND/2095639; Supplier 1: Digi-Key; Supplier Part Number 1: ZLDO1117K33DICT-ND

## Sheet Mainboard_Debug_Interface.SchDoc
size A4
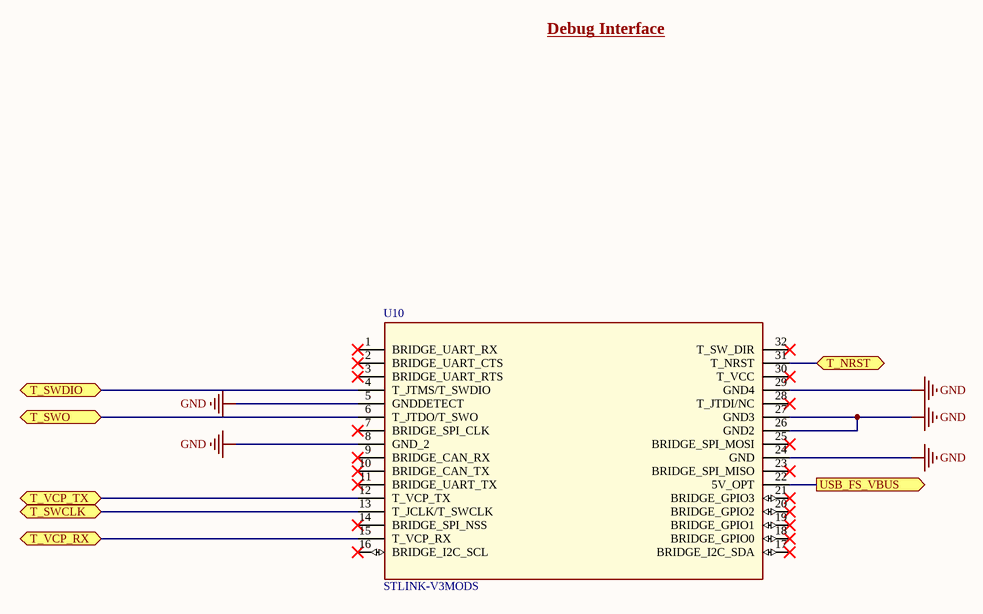
[diagram p7: Mainboard_Debug_Interface.SchDoc]

### Parts
U10  STLINK-V3MODS  [STLINK-V3MODS]

### Ports
T_NRST (bidir), T_SWCLK (bidir), T_SWDIO (bidir), T_SWO (bidir), T_VCP_RX (bidir), T_VCP_TX (bidir), USB_FS_VBUS (out)

### Nets
GND: U10.5(GNDDETECT) U10.8(GND_2) U10.24(GND) U10.26(GND2) U10.27(GND3) U10.29(GND4)
NRST: U10.31(T_NRST) ; port T_NRST
NetF1_1: U10.22(5V_OPT) ; port USB_FS_VBUS
NetU10_4: U10.4(T_JTMS/T_SWDIO) ; port T_SWDIO
NetU10_6: U10.6(T_JTDO/T_SWO) ; port T_SWO
NetU10_12: U10.12(T_VCP_TX) ; port T_VCP_TX
NetU10_13: U10.13(T_JCLK/T_SWCLK) ; port T_SWCLK
NetU10_15: U10.15(T_VCP_RX) ; port T_VCP_RX

Not connected (* = marked no-connect by the designer): U10 1(BRIDGE_UART_RX)* 2(BRIDGE_UART_CTS)* 3(BRIDGE_UART_RTS)* 7(BRIDGE_SPI_CLK)* 9(BRIDGE_CAN_RX)* 10(BRIDGE_CAN_TX)* 11(BRIDGE_UART_TX)* 14(BRIDGE_SPI_NSS)* 16(BRIDGE_I2C_SCL)* 17(BRIDGE_I2C_SDA)* 18(BRIDGE_GPIO0)* 19(BRIDGE_GPIO1)* 20(BRIDGE_GPIO2)* 21(BRIDGE_GPIO3)* 23(BRIDGE_SPI_MISO)* 25(BRIDGE_SPI_MOSI)* 28(T_JTDI/NC)* 30(T_VCC)* 32(T_SW_DIR)*

### Notes on the sheet
- Debug Interface

### Library data of the parts
U10 = STLINK-V3MODS: STM32 - Debugger, Programmer (In-Circuit/In-System); MF: STMicroelectronics; MP: STLINK-V3MODS; Price: $12.15; ComponentLink1Description: Digikey; ComponentLink1URL: https://www.digikey.ca/en/products/detail/stmicroelectronics/stlink-v3mods/11610874; ComponentLink2Description: SnapEDA; ComponentLink2URL: https://www.snapeda.com/parts/STLINK-V3MODS/STMicroelectronics/view-part/; ComponentLink3Description: Datasheet; ComponentLink3URL: https://www.st.com/resource/en/data_brief/stlink-v3mods.pdf; Digikey: 497-STLINK-V3MODS-ND